# Altium project dxp.PrjPcb (part 1 of 2)
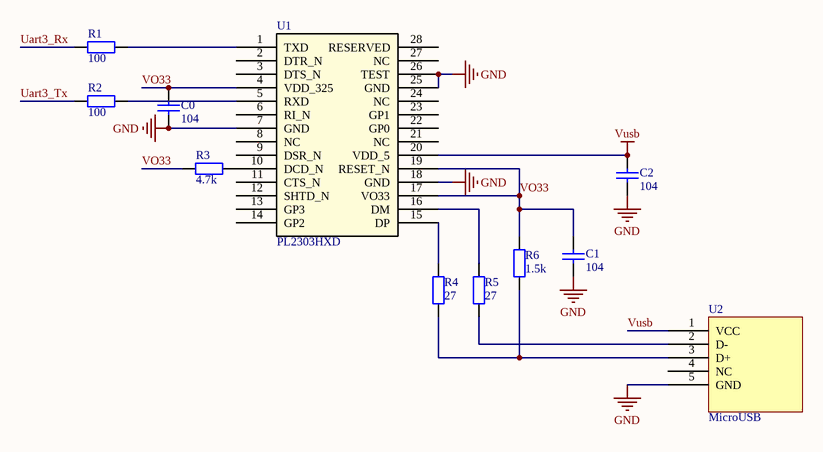
[diagram p0: PL2303EVM.SchDoc]
17 sheets, 492 parts. Net scope: flat (ports and power ports of the same name join across sheets).
Board files: PL2303EVM.PcbDoc, Cam.PcbDoc, RT8065.PcbDoc, FxxZx.PcbDoc, Stlink.PcbDoc, ArmPcb.PcbDoc, DRV8313EVM.PcbDoc, Board.PcbDoc, MPU6050EVM.PcbDoc, MainCtrl.PcbDoc, UccMod.PcbDoc, DRV8711MOD.PcbDoc, LM2596MOD.PcbDoc, Printer.PcbDoc
Sheets:
  PL2303EVM.SchDoc
  RT8065.SchDoc
  FxxVx.SchDoc
  FxxZx.SchDoc
  Stlink.SchDoc
  ArmPcb.SchDoc
  ST_All.SchDoc
  DRV8313EVM.SchDoc
  MPU6050EVM.SchDoc
  MPU9250EVM.SchDoc
  LM2596MOD.SchDoc
  BQ34Z100EVM.SchDoc
  MainCtrl.SchDoc
  DRV8711MOD.SchDoc
  UCCMod.SchDoc
  Opa365Mod.SchDoc
  Printer.SchDoc

## Sheet PL2303EVM.SchDoc
size A4

### Parts
(Parts that share a designator on the sheet are numbered #1, #2 ... from top to bottom, then left to right.)
C0  104  [0805]
C1#1  104  [0805]
C2#1  104  [0805]
R1#1  100  [0805]
R2#1  100  [0805]
R3#1  4.7k  [0805]
R4#1  27  [0805]
R5#1  27  [0805]
R6#1  1.5k  [0805]
U1#1  PL2303HXD  [SSOP28]
U2#1  MicroUSB  [USB/SM0.8-6H5]

### Nets
GND: C0.2 C1#1.2 C2#1.2 U1#1.7(GND) U1#1.18(GND) U1#1.25(GND) U1#1.26(TEST) U2#1.5(GND)
Vusb: C2#1.1 U1#1.20(VDD_5) U2#1.1(VCC)
Uart3_Rx: R1#1.2
Uart3_Tx: R2#1.2
VO33: C0.1 C1#1.1 R3#1.2 R6#1.2 U1#1.4(VDD_325) U1#1.17(VO33) U1#1.19(RESET_N)
NetR1#1_1: R1#1.1 U1#1.1(TXD)
NetR2#1_1: R2#1.1 U1#1.5(RXD)
NetR3#1_1: R3#1.1 U1#1.10(DCD_N)
NetR4#1_1: R4#1.1 R6#1.1 U2#1.3(D+)
NetR4#1_2: R4#1.2 U1#1.15(DP)
NetR5#1_1: R5#1.1 U2#1.2(D-)
NetR5#1_2: R5#1.2 U1#1.16(DM)

Not connected (* = marked no-connect by the designer): U1#1 2(DTR_N) 3(DTS_N) 6(RI_N) 8(NC) 9(DSR_N) 11(CTS_N) 12(SHTD_N) 13(GP3) 14(GP2) 21(NC) 22(GP0) 23(GP1) 24(NC) 27(NC) 28(RESERVED); U2#1 4(NC)

### Library data of the parts
C0 C1#1 C2#1 = C: Capacitor; Published: 8-Jun-2000; LatestRevisionDate: 17-Jul-2002; LatestRevisionNote: Re-released for DXP Platform.; PackageReference: RAD-0.3; Publisher: Altium Limited; PackageDescription: Radial Cap, Thru-Hole; 2 Leads; 0.3 in Pin Spacing
R1#1 R2#1 R3#1 R4#1 R5#1 R6#1 = R: Resistor; Published: 8-Jun-2000; LatestRevisionDate: 17-Jul-2002; LatestRevisionNote: Re-released for DXP Platform.; PackageReference: AXIAL-0.4; Publisher: Altium Limited; PackageDescription: Axial Device, Thru-Hole; 2 Leads; 0.4 in Pin Spacing
U1#1 = PL2303HXD: Driver; Manufacturer_Part_Number: tlc5916-q1_d_16; GENERIC_PART_NUMBER: TLC5916-Q1; Vendor: Texas Instruments; PACKAGE_DESIGNATOR: D; PIN_COUNT: 16; FAMILY_NAME: LED DRIVER; INDUSTRY_STD_PKG_TYPE: SOIC; Manufacturer: Texas Instruments; Datasheet_URL: http://www.ti.com/lit/gpn/TLC5916-Q1; Value: Value; Type: Type; RefDes: RefDes

## Sheet RT8065.SchDoc
size A4
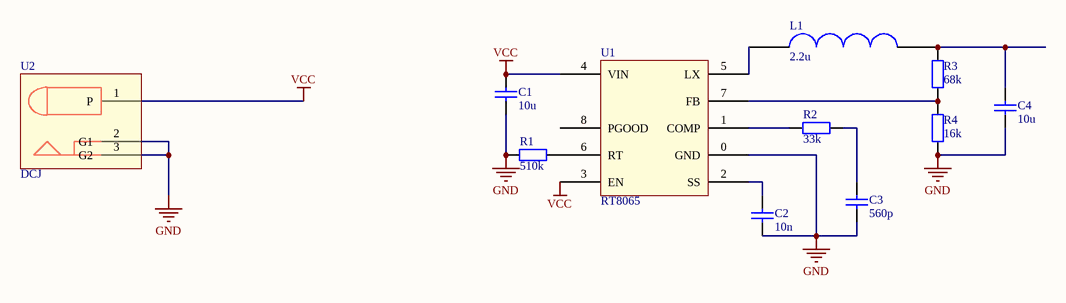
[diagram p1: RT8065.SchDoc]

### Parts
(Parts that share a designator on the sheet are numbered #1, #2 ... from top to bottom, then left to right.)
C1#2  10u  [0805]
C2#2  10n  [0805]
C3#1  560p  [0805]
C4#1  10u  [0805]
L1#1  2.2u  [L3X3MM]
R1#2  510k  [0805]
R2#2  33k  [0805]
R3#2  68k  [0805]
R4#2  16k  [0805]
U1#2  RT8065  [PSOP-8]
U2#2  DCJ  [JACK-2_5MM_B]

### Nets
GND: C1#2.1 C2#2.1 C3#1.2 C4#1.2 R1#2.1 R4#2.1 U1#2.0(GND) U2#2.2(G1) U2#2.3(G2)
VCC: C1#2.2 U1#2.3(EN) U1#2.4(VIN) U2#2.1(P)
NetC2#2_2: C2#2.2 U1#2.2(SS)
NetC3#1_1: C3#1.1 R2#2.2
NetC4#1_1: C4#1.1 L1#1.2 R3#2.2
NetL1#1_1: L1#1.1 U1#2.5(LX)
NetR1#2_2: R1#2.2 U1#2.6(RT)
NetR2#2_1: R2#2.1 U1#2.1(COMP)
NetR3#2_1: R3#2.1 R4#2.2 U1#2.7(FB)

Not connected (* = marked no-connect by the designer): U1#2 8(PGOOD)

### Library data of the parts
C1#2 C2#2 C3#1 C4#1 = C: Capacitor; Published: 8-Jun-2000; LatestRevisionDate: 17-Jul-2002; LatestRevisionNote: Re-released for DXP Platform.; PackageReference: RAD-0.3; Publisher: Altium Limited; PackageDescription: Radial Cap, Thru-Hole; 2 Leads; 0.3 in Pin Spacing
L1#1 = L
R1#2 R2#2 R3#2 R4#2 = R: Resistor; Published: 8-Jun-2000; LatestRevisionDate: 17-Jul-2002; LatestRevisionNote: Re-released for DXP Platform.; PackageReference: AXIAL-0.4; Publisher: Altium Limited; PackageDescription: Axial Device, Thru-Hole; 2 Leads; 0.4 in Pin Spacing

## Sheet FxxVx.SchDoc
size A2
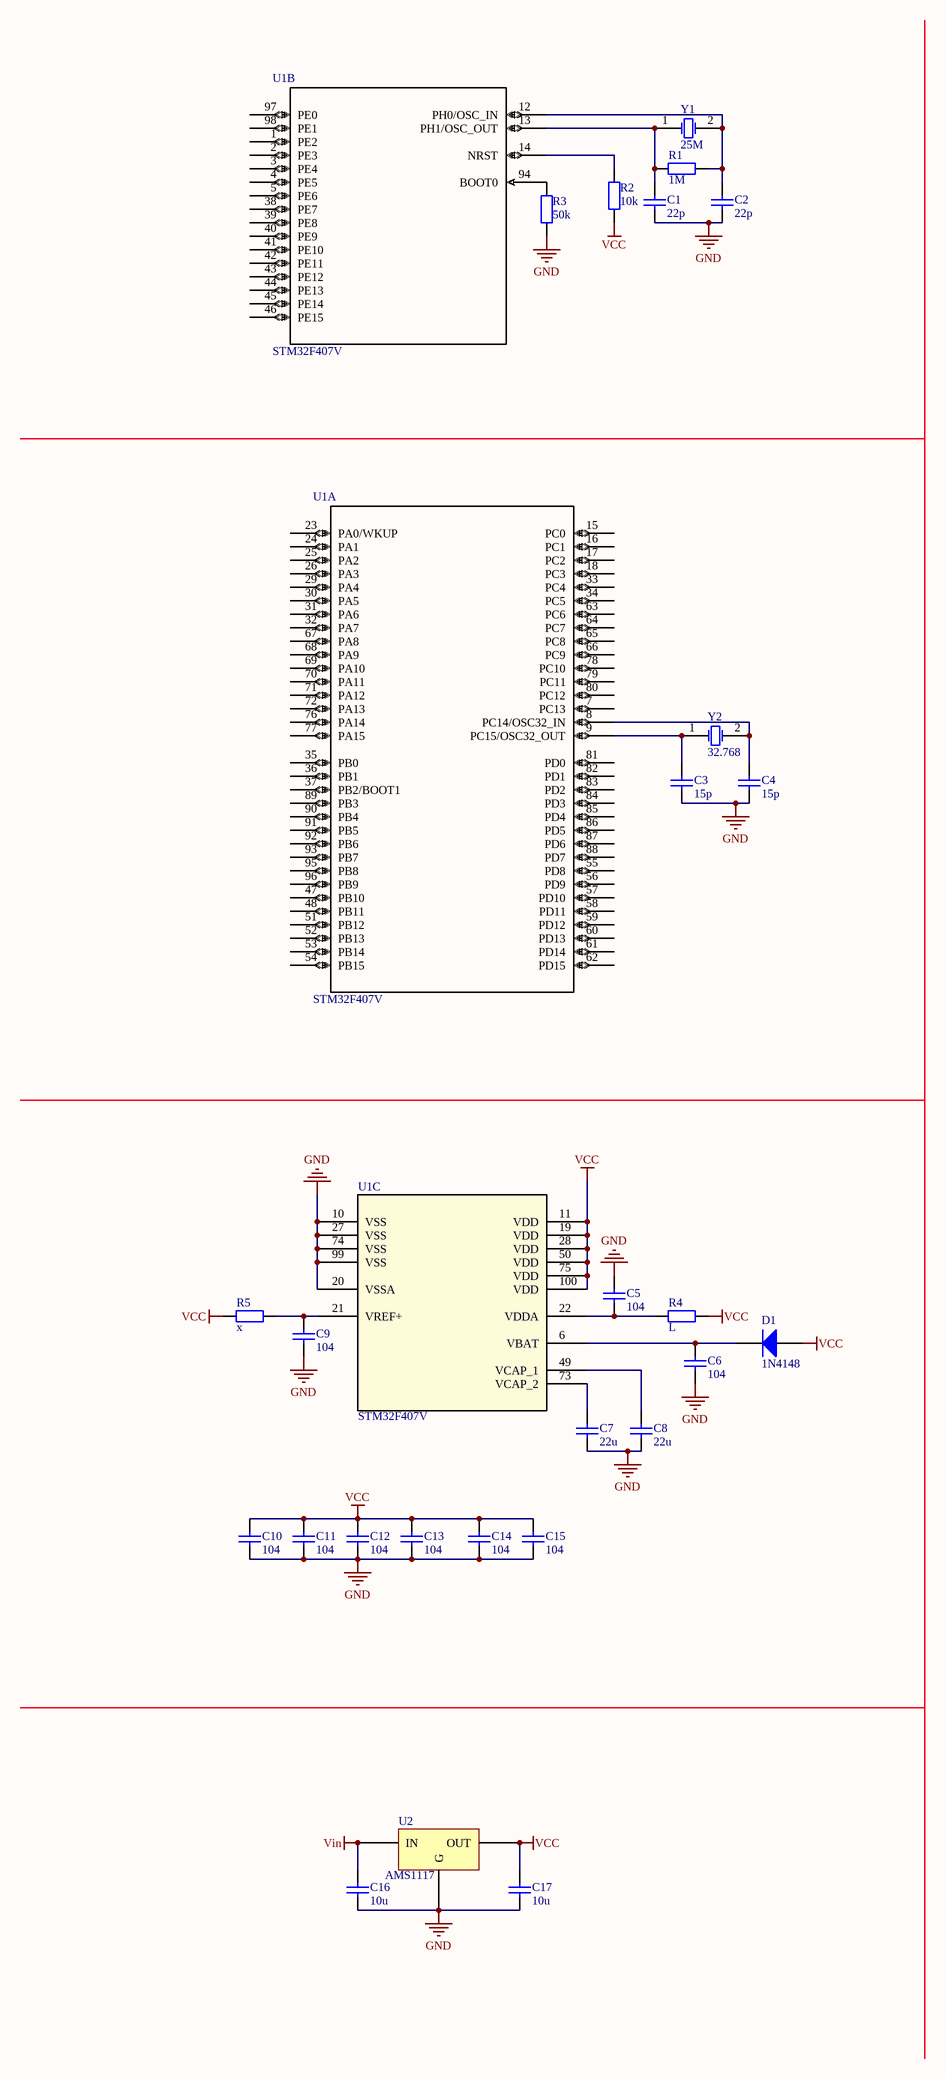
[diagram p2: FxxVx.SchDoc]

### Parts
(Parts that share a designator on the sheet are numbered #1, #2 ... from top to bottom, then left to right.)
C1#3  22p  [0603]
C2#3  22p  [0603]
C3#2  15p  [0603]
C4#2  15p  [0603]
C5#1  104  [0603]
C6#1  104  [0603]
C7#1  22u  [0603]
C8#1  22u  [0603]
C9#1  104  [0603]
C10#1  104  [0603]
C11#1  104  [0603]
C12#1  104  [0603]
C13#1  104  [0603]
C14#1  104  [0603]
C15#1  104  [0603]
C16#1  10u  [0603]
C17#1  10u  [0603]
D1#1  1N4148  [0603]
R1#3  1M  [0603]
R2#3  10k  [0603]
R3#3  50k  [0603]
R4#3  L  [0603]
R5#2  x  [0603]
U1#3  STM32F407V  [LQFP100-14x14mm]  (parts A,B,C of 3)
U2#3  AMS1117
Y1#1  25M  [3225-4]
Y2#1  32.768  [3215-2]

### Nets
GND: C1#3.1 C2#3.1 C3#2.1 C4#2.1 C5#1.2 C6#1.1 C7#1.1 C8#1.1 C9#1.1 C10#1.1 C11#1.1 C12#1.1 C13#1.1 C14#1.1 C15#1.1 C16#1.1 C17#1.1 R3#3.1 U1#3.10(VSS) U1#3.20(VSSA) U1#3.27(VSS) U1#3.74(VSS) U1#3.99(VSS) U2#3.1(G)
VCC: C10#1.2 C11#1.2 C12#1.2 C13#1.2 C14#1.2 C15#1.2 C17#1.2 D1#1.1(A) R2#3.1 R4#3.1 R5#2.2 U1#3.11(VDD) U1#3.19(VDD) U1#3.28(VDD) U1#3.50(VDD) U1#3.75(VDD) U1#3.100(VDD) U2#3.2(OUT)
Vin: C16#1.2 U2#3.3(IN)
NetC1#3_2: C1#3.2 R1#3.1 U1#3.13(PH1/OSC_OUT) Y1#1.1(OSC1)
NetC2#3_2: C2#3.2 R1#3.2 U1#3.12(PH0/OSC_IN) Y1#1.2(OSC2)
NetC3#2_2: C3#2.2 U1#3.9(PC15/OSC32_OUT) Y2#1.1(OSC1)
NetC4#2_2: C4#2.2 U1#3.8(PC14/OSC32_IN) Y2#1.2(OSC2)
NetC5#1_1: C5#1.1 R4#3.2 U1#3.22(VDDA)
NetC6#1_2: C6#1.2 D1#1.2(K) U1#3.6(VBAT)
NetC7#1_2: C7#1.2 U1#3.73(VCAP_2)
NetC8#1_2: C8#1.2 U1#3.49(VCAP_1)
NetC9#1_2: C9#1.2 R5#2.1 U1#3.21(VREF+)
NetR2#3_2: R2#3.2 U1#3.14(NRST)
NetR3#3_2: R3#3.2 U1#3.94(BOOT0)

Not connected (* = marked no-connect by the designer): U1#3 1(PE2) 2(PE3) 3(PE4) 4(PE5) 5(PE6) 7(PC13) 15(PC0) 16(PC1) 17(PC2) 18(PC3) 23(PA0/WKUP) 24(PA1) 25(PA2) 26(PA3) 29(PA4) 30(PA5) 31(PA6) 32(PA7) 33(PC4) 34(PC5) 35(PB0) 36(PB1) 37(PB2/BOOT1) 38(PE7) 39(PE8) 40(PE9) 41(PE10) 42(PE11) 43(PE12) 44(PE13) 45(PE14) 46(PE15) 47(PB10) 48(PB11) 51(PB12) 52(PB13) 53(PB14) 54(PB15) 55(PD8) 56(PD9) 57(PD10) 58(PD11) 59(PD12) 60(PD13) 61(PD14) 62(PD15) 63(PC6) 64(PC7) 65(PC8) 66(PC9) 67(PA8) 68(PA9) 69(PA10) 70(PA11) 71(PA12) 72(PA13) 76(PA14) 77(PA15) 78(PC10) 79(PC11) 80(PC12) 81(PD0) 82(PD1) 83(PD2) 84(PD3) 85(PD4) 86(PD5) 87(PD6) 88(PD7) 89(PB3) 90(PB4) 91(PB5) 92(PB6) 93(PB7) 95(PB8) 96(PB9) 97(PE0) 98(PE1)

### Notes on the sheet
- Title
- Size:
- Date:
- File:
- A2
- Number:
- Time:
- Revision:
- Sheet
- of

### Library data of the parts
C1#3 C2#3 C3#2 C4#2 C5#1 C6#1 C7#1 C8#1 C9#1 C10#1 C11#1 C12#1 C13#1 C14#1 C15#1 C16#1 C17#1 = C: Capacitor; Published: 8-Jun-2000; LatestRevisionDate: 17-Jul-2002; LatestRevisionNote: Re-released for DXP Platform.; PackageReference: RAD-0.3; Publisher: Altium Limited; PackageDescription: Radial Cap, Thru-Hole; 2 Leads; 0.3 in Pin Spacing
D1#1 = D: Diode; Published: 8-Jun-2000; LatestRevisionDate: 17-Jul-2002; LatestRevisionNote: Re-released for DXP Platform.; PackageVersion: Sep-1996; PackageReference: SMC; Publisher: Altium Limited; PackageDescription: DO-214-AB/SMC; 2 C-Bend Leads; Body 7.9 x 5.9 mm, inc. leads (LxW); Code_JEDEC: DO-214-AB
R1#3 R2#3 R3#3 R4#3 R5#2 = R: Resistor; Published: 8-Jun-2000; LatestRevisionDate: 17-Jul-2002; LatestRevisionNote: Re-released for DXP Platform.; PackageReference: AXIAL-0.4; Publisher: Altium Limited; PackageDescription: Axial Device, Thru-Hole; 2 Leads; 0.4 in Pin Spacing
U1#3 = STM32F407V: Imported; Manufacturer_Part_Number: stm32f4xxv2; Vendor: STMicroelectronics; C: Copyright (C) 2016 Accelerated Designs. All rights reserved; Copyright: Copyright (C) 2016 Accelerated Designs. All rights reserved; RefDes: RefDes; Type: Type; Value: Value
Y1#1 = XTAL: Crystal Oscillator; pin to pad: 2>3; Published: 8-Jun-2000; LatestRevisionDate: 17-Jul-2002; LatestRevisionNote: Re-released for DXP Platform.; Publisher: Altium Limited
Y2#1 = XTAL: Crystal Oscillator; Published: 8-Jun-2000; LatestRevisionDate: 17-Jul-2002; LatestRevisionNote: Re-released for DXP Platform.; Publisher: Altium Limited

## Sheet FxxZx.SchDoc
size A2
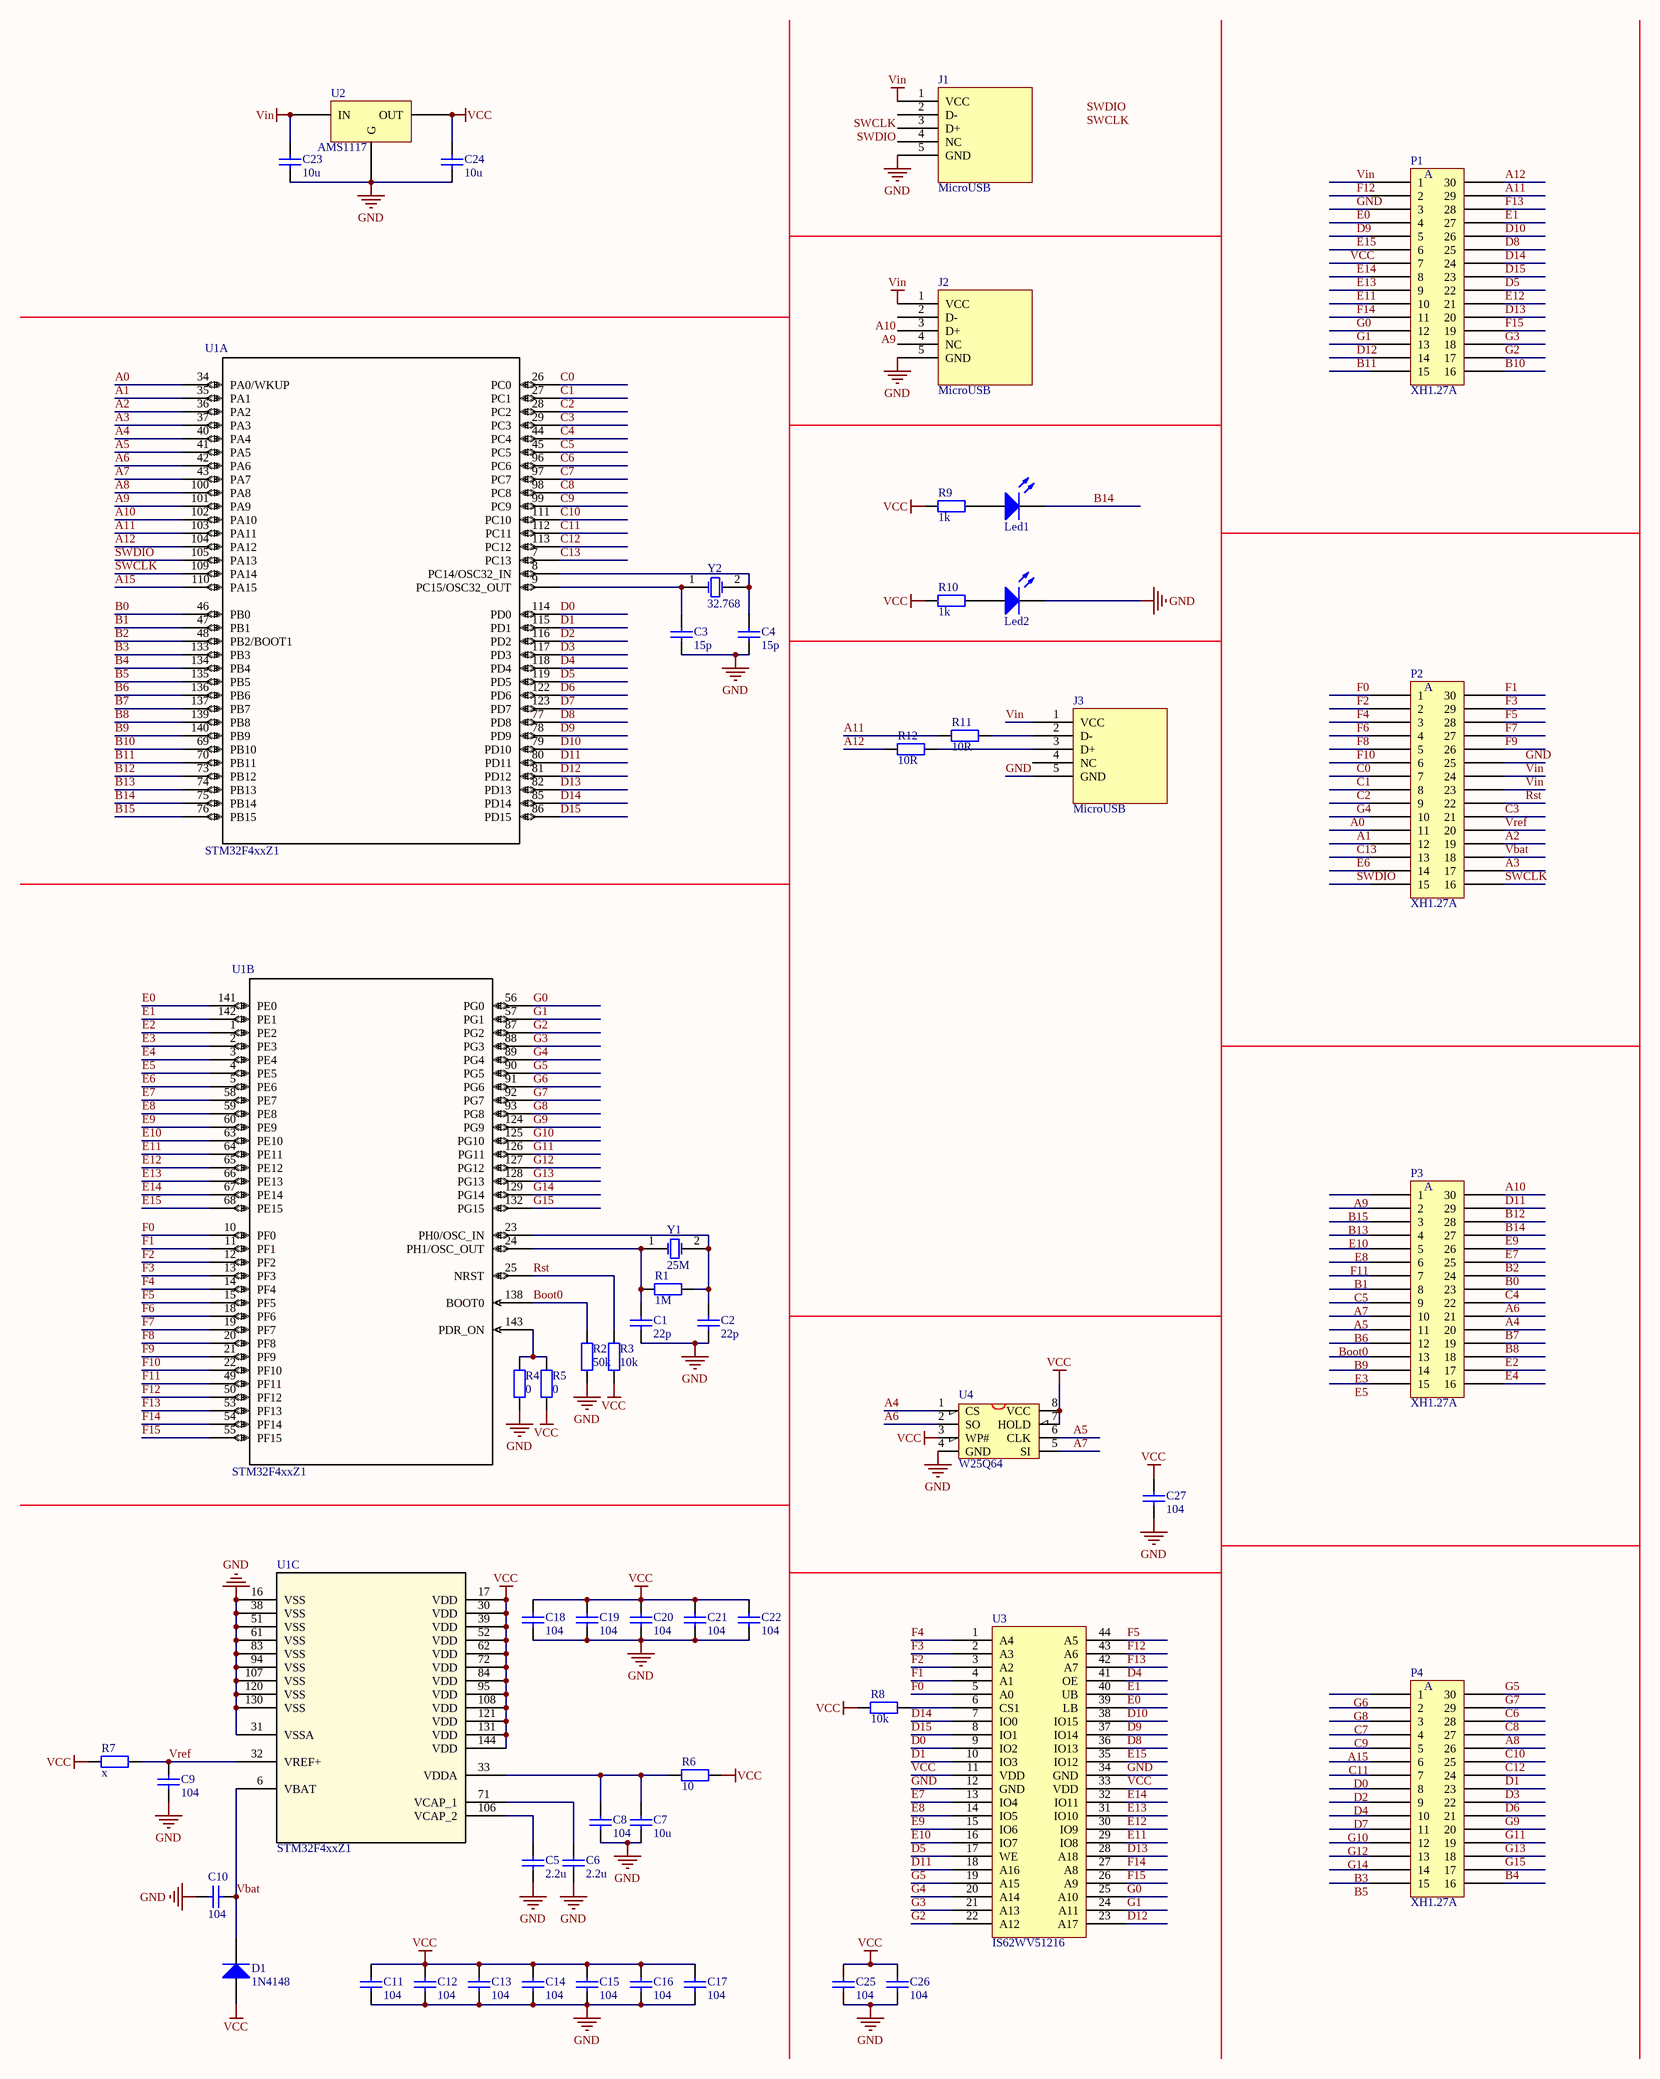
[diagram p3: FxxZx.SchDoc]

### Parts
(Parts that share a designator on the sheet are numbered #1, #2 ... from top to bottom, then left to right.)
C1#4  22p  [0603]
C2#4  22p  [0603]
C3#3  15p  [0603]
C4#3  15p  [0603]
C5#2  2.2u  [0603]
C6#2  2.2u  [0603]
C7#2  10u  [0603]
C8#2  104  [0603]
C9#2  104  [0603]
C10#2  104  [0603]
C11#2  104  [0603]
C12#2  104  [0603]
C13#2  104  [0603]
C14#2  104  [0603]
C15#2  104  [0603]
C16#2  104  [0603]
C17#2  104  [0603]
C18#1  104  [0603]
C19#1  104  [0603]
C20#1  104  [0603]
C21#1  104  [0603]
C22#1  104  [0603]
C23#1  10u  [0805]
C24#1  10u  [0805]
C25#1  104  [0603]
C26#1  104  [0603]
C27#1  104  [0603]
D1#2  1N4148  [0603]
J1#1  MicroUSB  [USB/SM0.8-6H5]
J2#1  MicroUSB  [USB/SM0.8-6H5]
J3#1  MicroUSB  [USB/SM0.8-6H5]
Led1  Red  [0805]  (value not drawn)
Led2  Red  [0805]  (value not drawn)
P1#1  XH1.27A  [XH1.27A]
P2#1  XH1.27A  [XH1.27A]
P3#1  XH1.27A  [XH1.27A]
P4#1  XH1.27A  [XH1.27A]
R1#4  1M  [0603]
R2#4  50k  [0603]
R3#4  10k  [0603]
R4#4  0  [0603]
R5#3  0  [0603]
R6#2  10  [0603]
R7#1  x  [0603]
R8#1  10k  [0603]
R9#1  1k  [0603]
R10#1  1k  [0603]
R11#1  10R  [0603]
R12#1  10R  [0603]
U1#4  STM32F4xxZ1  [LQFP144-20x20mm]  (parts A,B,C of 3)
U2#4  AMS1117  [SOT-89]
U3#1  IS62WV51216  [tsop-44]
U4#1  W25Q64  [SOIC-8]
Y1#2  25M  [3225-4]
Y2#2  32.768  [3215-2]

### Nets
GND: C1#4.1 C2#4.1 C3#3.1 C4#3.1 C5#2.1 C6#2.1 C7#2.1 C8#2.1 C9#2.1 C10#2.1 C11#2.1 C12#2.1 C13#2.1 C14#2.1 C15#2.1 C16#2.1 C17#2.1 C18#1.1 C19#1.1 C20#1.1 C21#1.1 C22#1.1 C23#1.1 C24#1.1 C25#1.1 C26#1.1 C27#1.1 J1#1.5(GND) J2#1.5(GND) J3#1.5(GND) Led2.2(K) P1#1.3 P2#1.25 R2#4.1 R4#4.1 U1#4.16(VSS) U1#4.31(VSSA) U1#4.38(VSS) U1#4.51(VSS) U1#4.61(VSS) U1#4.83(VSS) U1#4.94(VSS) U1#4.107(VSS) U1#4.120(VSS) U1#4.130(VSS) U2#4.1(G) U3#1.12(GND) U3#1.34(GND) U4#1.4(GND)
VCC: C11#2.2 C12#2.2 C13#2.2 C14#2.2 C15#2.2 C16#2.2 C17#2.2 C18#1.2 C19#1.2 C20#1.2 C21#1.2 C22#1.2 C24#1.2 C25#1.2 C26#1.2 C27#1.2 D1#2.1(A) P1#1.7 R3#4.1 R5#3.1 R6#2.1 R7#1.2 R8#1.2 R9#1.2 R10#1.2 U1#4.17(VDD) U1#4.30(VDD) U1#4.39(VDD) U1#4.52(VDD) U1#4.62(VDD) U1#4.72(VDD) U1#4.84(VDD) U1#4.95(VDD) U1#4.108(VDD) U1#4.121(VDD) U1#4.131(VDD) U1#4.144(VDD) U2#4.2(OUT) U3#1.11(VDD) U3#1.33(VDD) U4#1.3(WP#) U4#1.7(HOLD) U4#1.8(VCC)
Vin: C23#1.2 J1#1.1(VCC) J2#1.1(VCC) J3#1.1(VCC) P1#1.1 P2#1.23 P2#1.24 U2#4.3(IN)
A0: P2#1.11 U1#4.34(PA0/WKUP)
A1: P2#1.12 U1#4.35(PA1)
A2: P2#1.19 U1#4.36(PA2)
A3: P2#1.17 U1#4.37(PA3)
A4: P3#1.20 U1#4.40(PA4) U4#1.1(CS)
A5: P3#1.10 U1#4.41(PA5) U4#1.6(CLK)
A6: P3#1.21 U1#4.42(PA6) U4#1.2(SO)
A7: P3#1.9 U1#4.43(PA7) U4#1.5(SI)
A8: P4#1.26 U1#4.100(PA8)
A9: J2#1.3(D+) P3#1.1 U1#4.101(PA9)
A10: J2#1.2(D-) P3#1.30 U1#4.102(PA10)
A11: P1#1.29 R11#1.2 U1#4.103(PA11)
A12: P1#1.30 R12#1.2 U1#4.104(PA12)
A15: P4#1.5 U1#4.110(PA15)
B0: P3#1.23 U1#4.46(PB0)
B1: P3#1.7 U1#4.47(PB1)
B2: P3#1.24 U1#4.48(PB2/BOOT1)
B3: P4#1.14 U1#4.133(PB3)
B4: P4#1.16 U1#4.134(PB4)
B5: P4#1.15 U1#4.135(PB5)
B6: P3#1.11 U1#4.136(PB6)
B7: P3#1.19 U1#4.137(PB7)
B8: P3#1.18 U1#4.139(PB8)
B9: P3#1.13 U1#4.140(PB9)
B10: P1#1.16 U1#4.69(PB10)
B11: P1#1.15 U1#4.70(PB11)
B12: P3#1.28 U1#4.73(PB12)
B13: P3#1.3 U1#4.74(PB13)
B14: Led1.2(K) P3#1.27 U1#4.75(PB14)
B15: P3#1.2 U1#4.76(PB15)
Boot0: P3#1.12 R2#4.2 U1#4.138(BOOT0)
C0: P2#1.7 U1#4.26(PC0)
C1: P2#1.8 U1#4.27(PC1)
C2: P2#1.9 U1#4.28(PC2)
C3: P2#1.21 U1#4.29(PC3)
C4: P3#1.22 U1#4.44(PC4)
C5: P3#1.8 U1#4.45(PC5)
C6: P4#1.28 U1#4.96(PC6)
C7: P4#1.3 U1#4.97(PC7)
C8: P4#1.27 U1#4.98(PC8)
C9: P4#1.4 U1#4.99(PC9)
C10: P4#1.25 U1#4.111(PC10)
C11: P4#1.6 U1#4.112(PC11)
C12: P4#1.24 U1#4.113(PC12)
C13: P2#1.13 U1#4.7(PC13)
D0: P4#1.7 U1#4.114(PD0) U3#1.9(IO2)
D1: P4#1.23 U1#4.115(PD1) U3#1.10(IO3)
D2: P4#1.8 U1#4.116(PD2)
D3: P4#1.22 U1#4.117(PD3)
D4: P4#1.9 U1#4.118(PD4) U3#1.41(OE)
D5: P1#1.22 U1#4.119(PD5) U3#1.17(WE)
D6: P4#1.21 U1#4.122(PD6)
D7: P4#1.10 U1#4.123(PD7)
D8: P1#1.25 U1#4.77(PD8) U3#1.36(IO13)
D9: P1#1.5 U1#4.78(PD9) U3#1.37(IO14)
D10: P1#1.26 U1#4.79(PD10) U3#1.38(IO15)
D11: P3#1.29 U1#4.80(PD11) U3#1.18(A16)
D12: P1#1.14 U1#4.81(PD12) U3#1.23(A17)
D13: P1#1.20 U1#4.82(PD13) U3#1.28(A18)
D14: P1#1.24 U1#4.85(PD14) U3#1.7(IO0)
D15: P1#1.23 U1#4.86(PD15) U3#1.8(IO1)
E0: P1#1.4 U1#4.141(PE0) U3#1.39(LB)
E1: P1#1.27 U1#4.142(PE1) U3#1.40(UB)
E2: P3#1.17 U1#4.1(PE2)
E3: P3#1.14 U1#4.2(PE3)
E4: P3#1.16 U1#4.3(PE4)
E5: P3#1.15 U1#4.4(PE5)
E6: P2#1.14 U1#4.5(PE6)
E7: P3#1.25 U1#4.58(PE7) U3#1.13(IO4)
E8: P3#1.5 U1#4.59(PE8) U3#1.14(IO5)
E9: P3#1.26 U1#4.60(PE9) U3#1.15(IO6)
E10: P3#1.4 U1#4.63(PE10) U3#1.16(IO7)
E11: P1#1.10 U1#4.64(PE11) U3#1.29(IO8)
E12: P1#1.21 U1#4.65(PE12) U3#1.30(IO9)
E13: P1#1.9 U1#4.66(PE13) U3#1.31(IO10)
E14: P1#1.8 U1#4.67(PE14) U3#1.32(IO11)
E15: P1#1.6 U1#4.68(PE15) U3#1.35(IO12)
F0: P2#1.1 U1#4.10(PF0) U3#1.5(A0)
F1: P2#1.30 U1#4.11(PF1) U3#1.4(A1)
F2: P2#1.2 U1#4.12(PF2) U3#1.3(A2)
F3: P2#1.29 U1#4.13(PF3) U3#1.2(A3)
F4: P2#1.3 U1#4.14(PF4) U3#1.1(A4)
F5: P2#1.28 U1#4.15(PF5) U3#1.44(A5)
F6: P2#1.4 U1#4.18(PF6)
F7: P2#1.27 U1#4.19(PF7)
F8: P2#1.5 U1#4.20(PF8)
F9: P2#1.26 U1#4.21(PF9)
F10: P2#1.6 U1#4.22(PF10)
F11: P3#1.6 U1#4.49(PF11)
F12: P1#1.2 U1#4.50(PF12) U3#1.43(A6)
F13: P1#1.28 U1#4.53(PF13) U3#1.42(A7)
F14: P1#1.11 U1#4.54(PF14) U3#1.27(A8)
F15: P1#1.19 U1#4.55(PF15) U3#1.26(A9)
G0: P1#1.12 U1#4.56(PG0) U3#1.25(A10)
G1: P1#1.13 U1#4.57(PG1) U3#1.24(A11)
G2: P1#1.17 U1#4.87(PG2) U3#1.22(A12)
G3: P1#1.18 U1#4.88(PG3) U3#1.21(A13)
G4: P2#1.10 U1#4.89(PG4) U3#1.20(A14)
G5: P4#1.30 U1#4.90(PG5) U3#1.19(A15)
G6: P4#1.1 U1#4.91(PG6)
G7: P4#1.29 U1#4.92(PG7)
G8: P4#1.2 U1#4.93(PG8)
G9: P4#1.20 U1#4.124(PG9)
G10: P4#1.11 U1#4.125(PG10)
G11: P4#1.19 U1#4.126(PG11)
G12: P4#1.12 U1#4.127(PG12)
G13: P4#1.18 U1#4.128(PG13)
G14: P4#1.13 U1#4.129(PG14)
G15: P4#1.17 U1#4.132(PG15)
Rst: P2#1.22 R3#4.2 U1#4.25(NRST)
SWCLK: J1#1.2(D-) P2#1.16 U1#4.109(PA14)
SWDIO: J1#1.3(D+) P2#1.15 U1#4.105(PA13)
Vbat: C10#2.2 D1#2.2(K) P2#1.18 U1#4.6(VBAT)
Vref: C9#2.2 P2#1.20 R7#1.1 U1#4.32(VREF+)
NetC1#4_2: C1#4.2 R1#4.1 U1#4.24(PH1/OSC_OUT) Y1#2.1(OSC1)
NetC2#4_2: C2#4.2 R1#4.2 U1#4.23(PH0/OSC_IN) Y1#2.2(OSC2)
NetC3#3_2: C3#3.2 U1#4.9(PC15/OSC32_OUT) Y2#2.1(OSC1)
NetC4#3_2: C4#3.2 U1#4.8(PC14/OSC32_IN) Y2#2.2(OSC2)
NetC5#2_2: C5#2.2 U1#4.106(VCAP_2)
NetC6#2_2: C6#2.2 U1#4.71(VCAP_1)
NetC7#2_2: C7#2.2 C8#2.2 R6#2.2 U1#4.33(VDDA)
NetJ3#1_2: J3#1.2(D-) R11#1.1
NetJ3#1_3: J3#1.3(D+) R12#1.1
NetLed1_1: Led1.1(A) R9#1.1
NetLed2_1: Led2.1(A) R10#1.1
NetR4#4_2: R4#4.2 R5#3.2 U1#4.143(PDR_ON)
NetR8#1_1: R8#1.1 U3#1.6(CS1)

Not connected (* = marked no-connect by the designer): J1#1 4(NC); J2#1 4(NC); J3#1 4(NC)

### Notes on the sheet
- Labels drawn without touching a wire or pin: SWCLK, SWDIO
- Title
- Size:
- Date:
- File:
- A2
- Number:
- Time:
- Revision:
- Sheet
- of
- (in symbol XH1.27A) A

### Library data of the parts
C1#4 C2#4 C3#3 C4#3 C5#2 C6#2 C7#2 C8#2 C9#2 C10#2 C11#2 C12#2 C13#2 C14#2 C15#2 C16#2 C17#2 C18#1 C19#1 C20#1 C21#1 C22#1 C23#1 C24#1 C25#1 C26#1 C27#1 = C: Capacitor; Published: 8-Jun-2000; LatestRevisionDate: 17-Jul-2002; LatestRevisionNote: Re-released for DXP Platform.; PackageReference: RAD-0.3; Publisher: Altium Limited; PackageDescription: Radial Cap, Thru-Hole; 2 Leads; 0.3 in Pin Spacing
D1#2 = D: Diode; Published: 8-Jun-2000; LatestRevisionDate: 17-Jul-2002; LatestRevisionNote: Re-released for DXP Platform.; PackageVersion: Sep-1996; PackageReference: SMC; Publisher: Altium Limited; PackageDescription: DO-214-AB/SMC; 2 C-Bend Leads; Body 7.9 x 5.9 mm, inc. leads (LxW); Code_JEDEC: DO-214-AB
Led1 Led2 = LED: Published: 8-Jun-2000; LatestRevisionDate: 08-Jul-2005; LatestRevisionNote: Mech Layer 1 removed.; PackageReference: LED-0; Publisher: Altium Limited; PackageDescription: LED; 2 Leads
R1#4 R2#4 R3#4 R4#4 R5#3 R6#2 R7#1 R8#1 R9#1 R10#1 R11#1 R12#1 = R: Resistor; Published: 8-Jun-2000; LatestRevisionDate: 17-Jul-2002; LatestRevisionNote: Re-released for DXP Platform.; PackageReference: AXIAL-0.4; Publisher: Altium Limited; PackageDescription: Axial Device, Thru-Hole; 2 Leads; 0.4 in Pin Spacing
U1#4 = STM32F4xxZ1: Imported; Vendor: STMicroelectronics; C: Copyright (C) 2016 Accelerated Designs. All rights reserved; Manufacturer_Part_Number: stm32f4xxz1; Copyright: Copyright (C) 2016 Accelerated Designs. All rights reserved; RefDes: RefDes; Type: Type; Value: Value
U4#1 = W25X16: W25X16;SST25VF016;MX25L1605
Y1#2 = XTAL: Crystal Oscillator; pin to pad: 2>3; Published: 8-Jun-2000; LatestRevisionDate: 17-Jul-2002; LatestRevisionNote: Re-released for DXP Platform.; Publisher: Altium Limited
Y2#2 = XTAL: Crystal Oscillator; Published: 8-Jun-2000; LatestRevisionDate: 17-Jul-2002; LatestRevisionNote: Re-released for DXP Platform.; Publisher: Altium Limited

## Sheet Stlink.SchDoc
size A4; Revision: B.2(PCB.SCH)
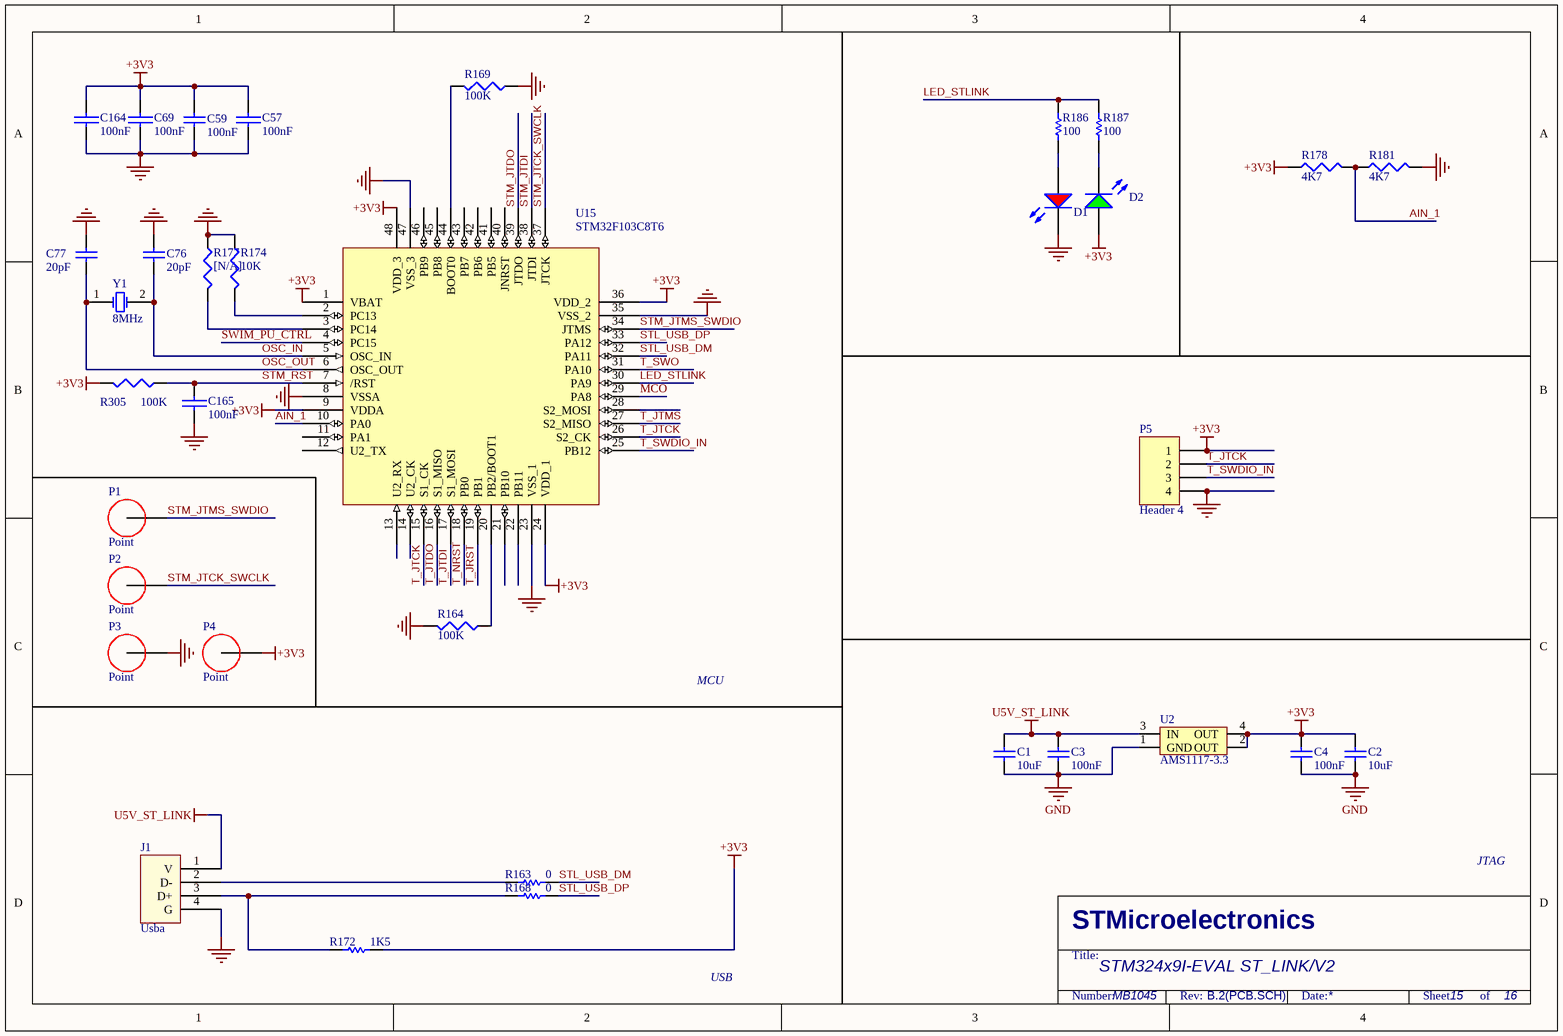
[diagram p4: Stlink.SchDoc]

### Parts
(Parts that share a designator on the sheet are numbered #1, #2 ... from top to bottom, then left to right.)
C1#5  10uF  [0805_C]
C2#5  10uF  [0805_C]
C3#4  100nF  [0603_C]
C4#4  100nF  [0603_C]
C57  100nF  [0603_C]
C59  100nF  [0603_C]
C69  100nF  [0603_C]
C76  20pF  [0603_C]
C77  20pF  [0603_C]
C164  100nF  [0603_C]
C165  100nF  [0603_C]
D1#3  红灯 0805  [0805_LED_S1]  (value not drawn)
D2#1  翠绿 0805  [0805_LED_S1]  (value not drawn)
J1#2  Usba  [UsbA]
P1#2  Point  [POINT]
P2#2  Point  [POINT]
P3#2  Point  [POINT]
P4#2  Point  [POINT]
P5#1  Header 4  [HDR1X4]
R163  0  [0603_R]
R164  100K  [0603_R]
R168  0  [0603_R]
R169  100K  [0603_R]
R172  1K5  [0603_R]
R174  10K  [0603_R]
R177  [N/A]  [0603_R]
R178  4K7  [0603_R]
R181  4K7  [0603_R]
R186  100  [0603_R]
R187  100  [0603_R]
R305  100K  [0603_R]
U2#5  AMS1117-3.3  [AMS1117]
U15  STM32F103C8T6  [LQFP-48_7x7x05P]
Y1#3  8MHz  [XTAL_US]

### Nets
+3V3: C2#5.2 C4#4.2 C57.2 C59.1 C69.2 C164.2 D2#1.A P4#2.1 P5#1.1 R172.1 R178.1 R305.2 U2#5.2(OUT) U2#5.4(OUT) U15.1(VBAT) U15.9(VDDA) U15.24(VDD_1) U15.36(VDD_2) U15.48(VDD_3)
GND: C1#5.1 C2#5.1 C3#4.1 C4#4.1 C57.1 C59.2 C69.1 C76.1 C77.1 C164.1 C165.1 D1#3.K J1#2.4(G) P3#2.1 P5#1.4 R164.2 R169.1 R174.1 R177.1 R181.2 U2#5.1(GND) U15.8(VSSA) U15.23(VSS_1) U15.35(VSS_2) U15.47(VSS_3)
U5V_ST_LINK: C1#5.2 C3#4.2 J1#2.1(V) U2#5.3(IN)
AIN_1: R178.2 R181.1 U15.10(PA0)
LED_STLINK: R186.1 R187.1 U15.30(PA9)
MCO: U15.29(PA8)
OSC_IN: C76.2 U15.5(OSC_IN) Y1#3.2(OSC2)
OSC_OUT: C77.2 U15.6(OSC_OUT) Y1#3.1(OSC1)
STL_USB_DM: R163.1 U15.32(PA11)
STL_USB_DP: R168.1 U15.33(PA12)
STM_JTCK_SWCLK: P2#2.1 U15.37(JTCK)
STM_JTDI: U15.38(JTDI)
STM_JTDO: U15.39(JTDO)
STM_JTMS_SWDIO: P1#2.1 U15.34(JTMS)
STM_RST: C165.2 R305.1 U15.7(/RST)
SWIM_PU_CTRL: U15.4(PC15)
T_JRST: U15.19(PB1)
T_JTCK: P5#1.2 U15.15(S1_CK) U15.26(S2_CK)
T_JTDI: U15.17(S1_MOSI)
T_JTDO: U15.16(S1_MISO)
T_JTMS: U15.27(S2_MISO)
T_NRST: U15.18(PB0)
T_SWDIO_IN: P5#1.3 U15.25(PB12)
T_SWO: U15.31(PA10)
NetD1#3_A: D1#3.A R186.2
NetD2#1_K: D2#1.K R187.2
NetJ1#2_2: J1#2.2(D-) R163.2
NetJ1#2_3: J1#2.3(D+) R168.2 R172.2
NetR164_1: R164.1 U15.20(PB2/BOOT1)
NetR169_2: R169.2 U15.44(BOOT0)
NetR174_2: R174.2 U15.2(PC13)
NetR177_2: R177.2 U15.3(PC14)

Not connected (* = marked no-connect by the designer): U15 11(PA1) 12(U2_TX) 13(U2_RX) 14(U2_CK) 21(PB10) 22(PB11) 28(S2_MOSI) 40(JNRST) 41(PB5) 42(PB6) 43(PB7) 45(PB8) 46(PB9)

### Notes on the sheet
- MCU
- JTAG
- USB
- STM324x9I-EVAL ST_LINK/V2
- MB1045
- 15
- 16
- STMicroelectronics
- Title:
- Number:
- Rev:
- Date:
- Sheet          of

### Library data of the parts
C1#5 C2#5 = 0805 10uF (106) 10% 25V: 贴片电容; ComponentLink1Description: 供应商链接; ComponentLink1URL: http://www.szlcsc.com/product/details_16532.html; Package: 0805; Supplier: LC; SuppliersPartNumber: C15850
C3#4 C4#4 = 0603 100nF (104) 10% 50V: 贴片电容; ComponentLink1Description: 供应商链接; ComponentLink1URL: http://www.szlcsc.com/product/details_15331.html; Package: 0603; Supplier: LC; SuppliersPartNumber: C14663
C57 C69 C164 C165 = CAP
C59 = Cap: Capacitor; Value: 10nF; Published: 8-Jun-2000; Revision: July-2002: Re-released for DXP Platform.; Publisher: Altium Limited
C76 C77 = Cap: Capacitor; Published: 8-Jun-2000; LatestRevisionDate: 17-Jul-2002; LatestRevisionNote: Re-released for DXP Platform.; PackageReference: RAD-0.3; Publisher: Altium Limited; Value: 20pF
D1#3 = 0805 红灯: 发光二极管; ComponentLink1Description: 供应商链接; ComponentLink1URL: http://www.szlcsc.com/product/details_2668.html; Package: 0805; Supplier: LC; SuppliersPartNumber: C2295
D2#1 = 0805 翠绿: 发光二极管; ComponentLink1Description: 供应商链接; ComponentLink1URL: http://www.szlcsc.com/product/details_2670.html; Package: 0805; Supplier: LC; SuppliersPartNumber: C2297
P5#1 = Header 4: Header, 4-Pin; LatestRevisionDate: 17-Jul-2002; LatestRevisionNote: Re-released for DXP Platform.; Publisher: Altium Limited
R163 R168 R172 R186 R187 = Res1: Resistor; Value: 1K; Published: 8-Jun-2000; Revision: July-2002: Re-released for DXP Platform.; Publisher: Altium Limited
R164 R169 R178 R181 R305 = RES1
R174 R177 = R: Right: 20; Bottom: 30
U2#5 = AMS1117
U15 = STM32F10x(48pin)
Y1#3 = XTAL: Crystal Oscillator; Published: 8-Jun-2000; LatestRevisionDate: 17-Jul-2002; LatestRevisionNote: Re-released for DXP Platform.; Publisher: Altium Limited

## Sheet ArmPcb.SchDoc
size A2
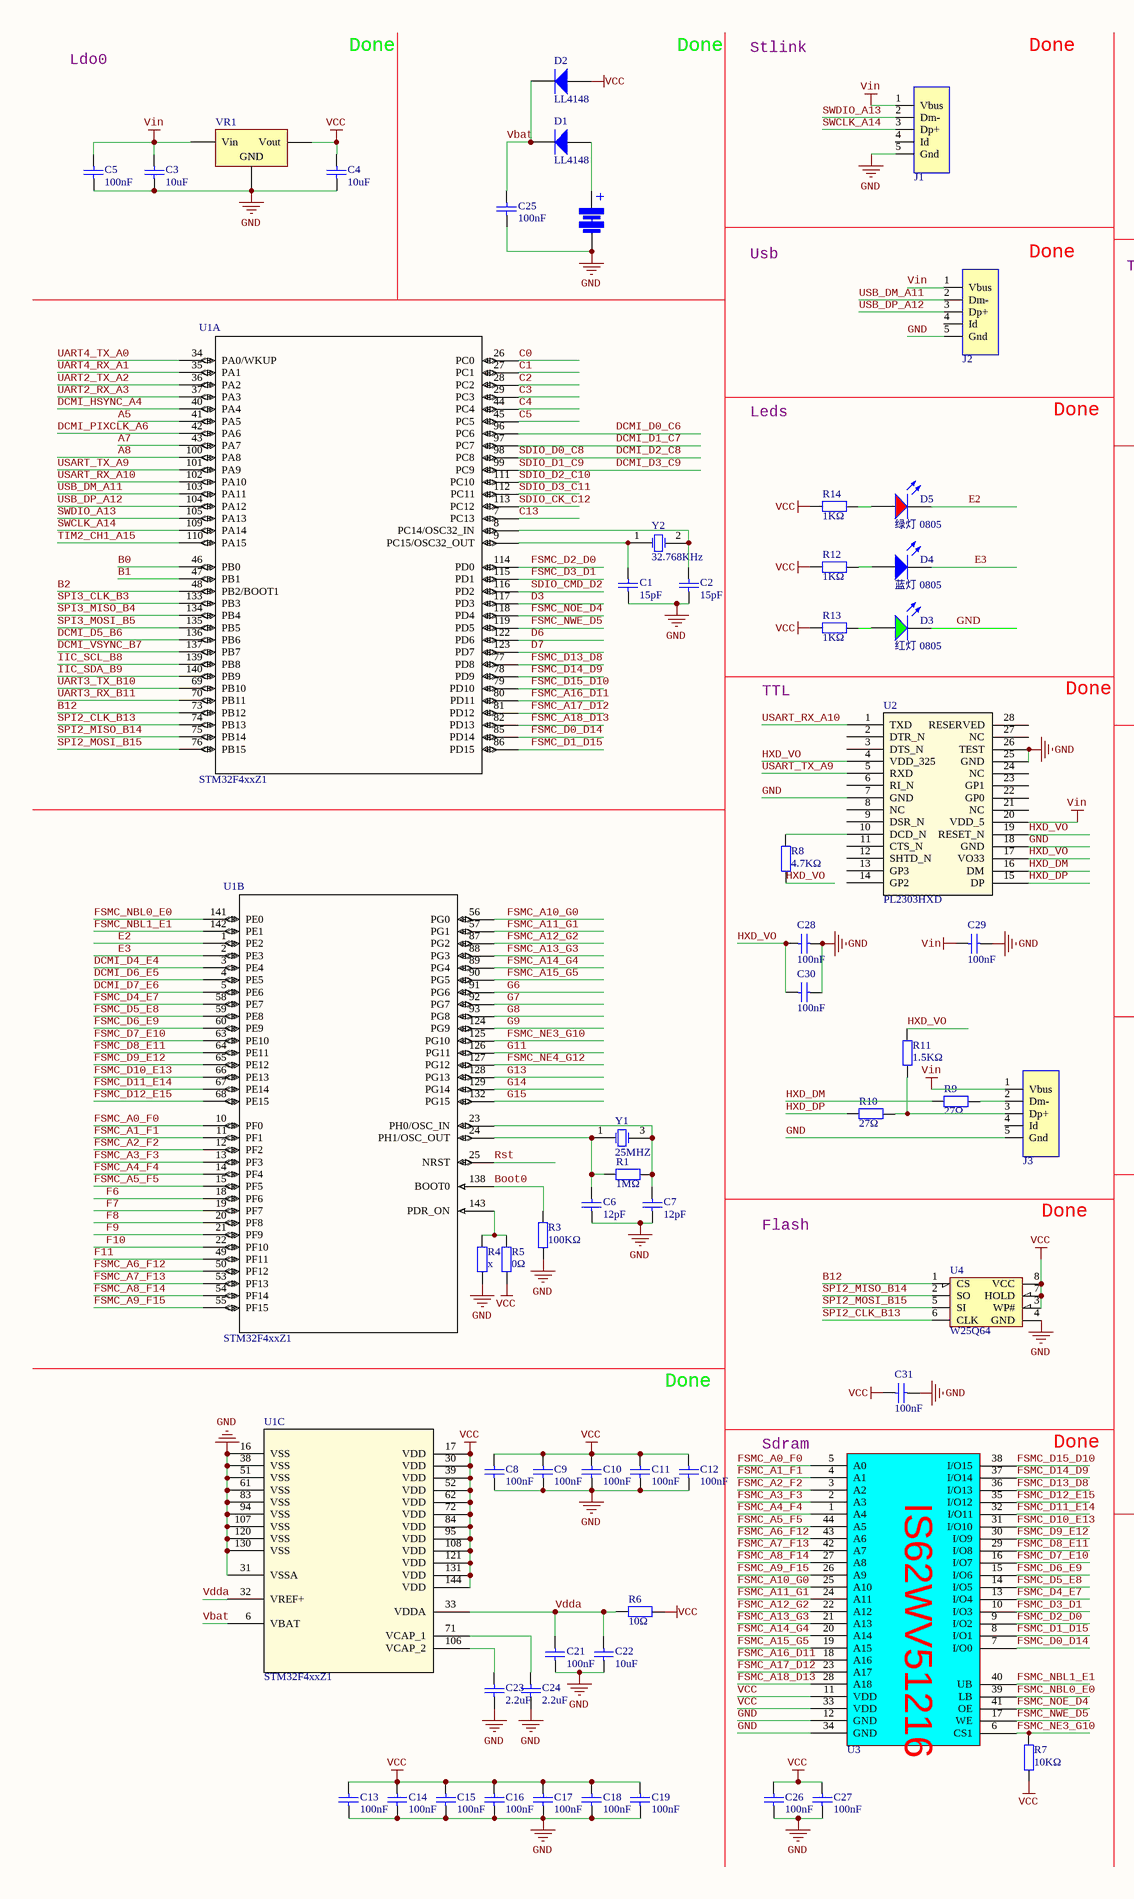
[diagram p5: ArmPcb.SchDoc, left]
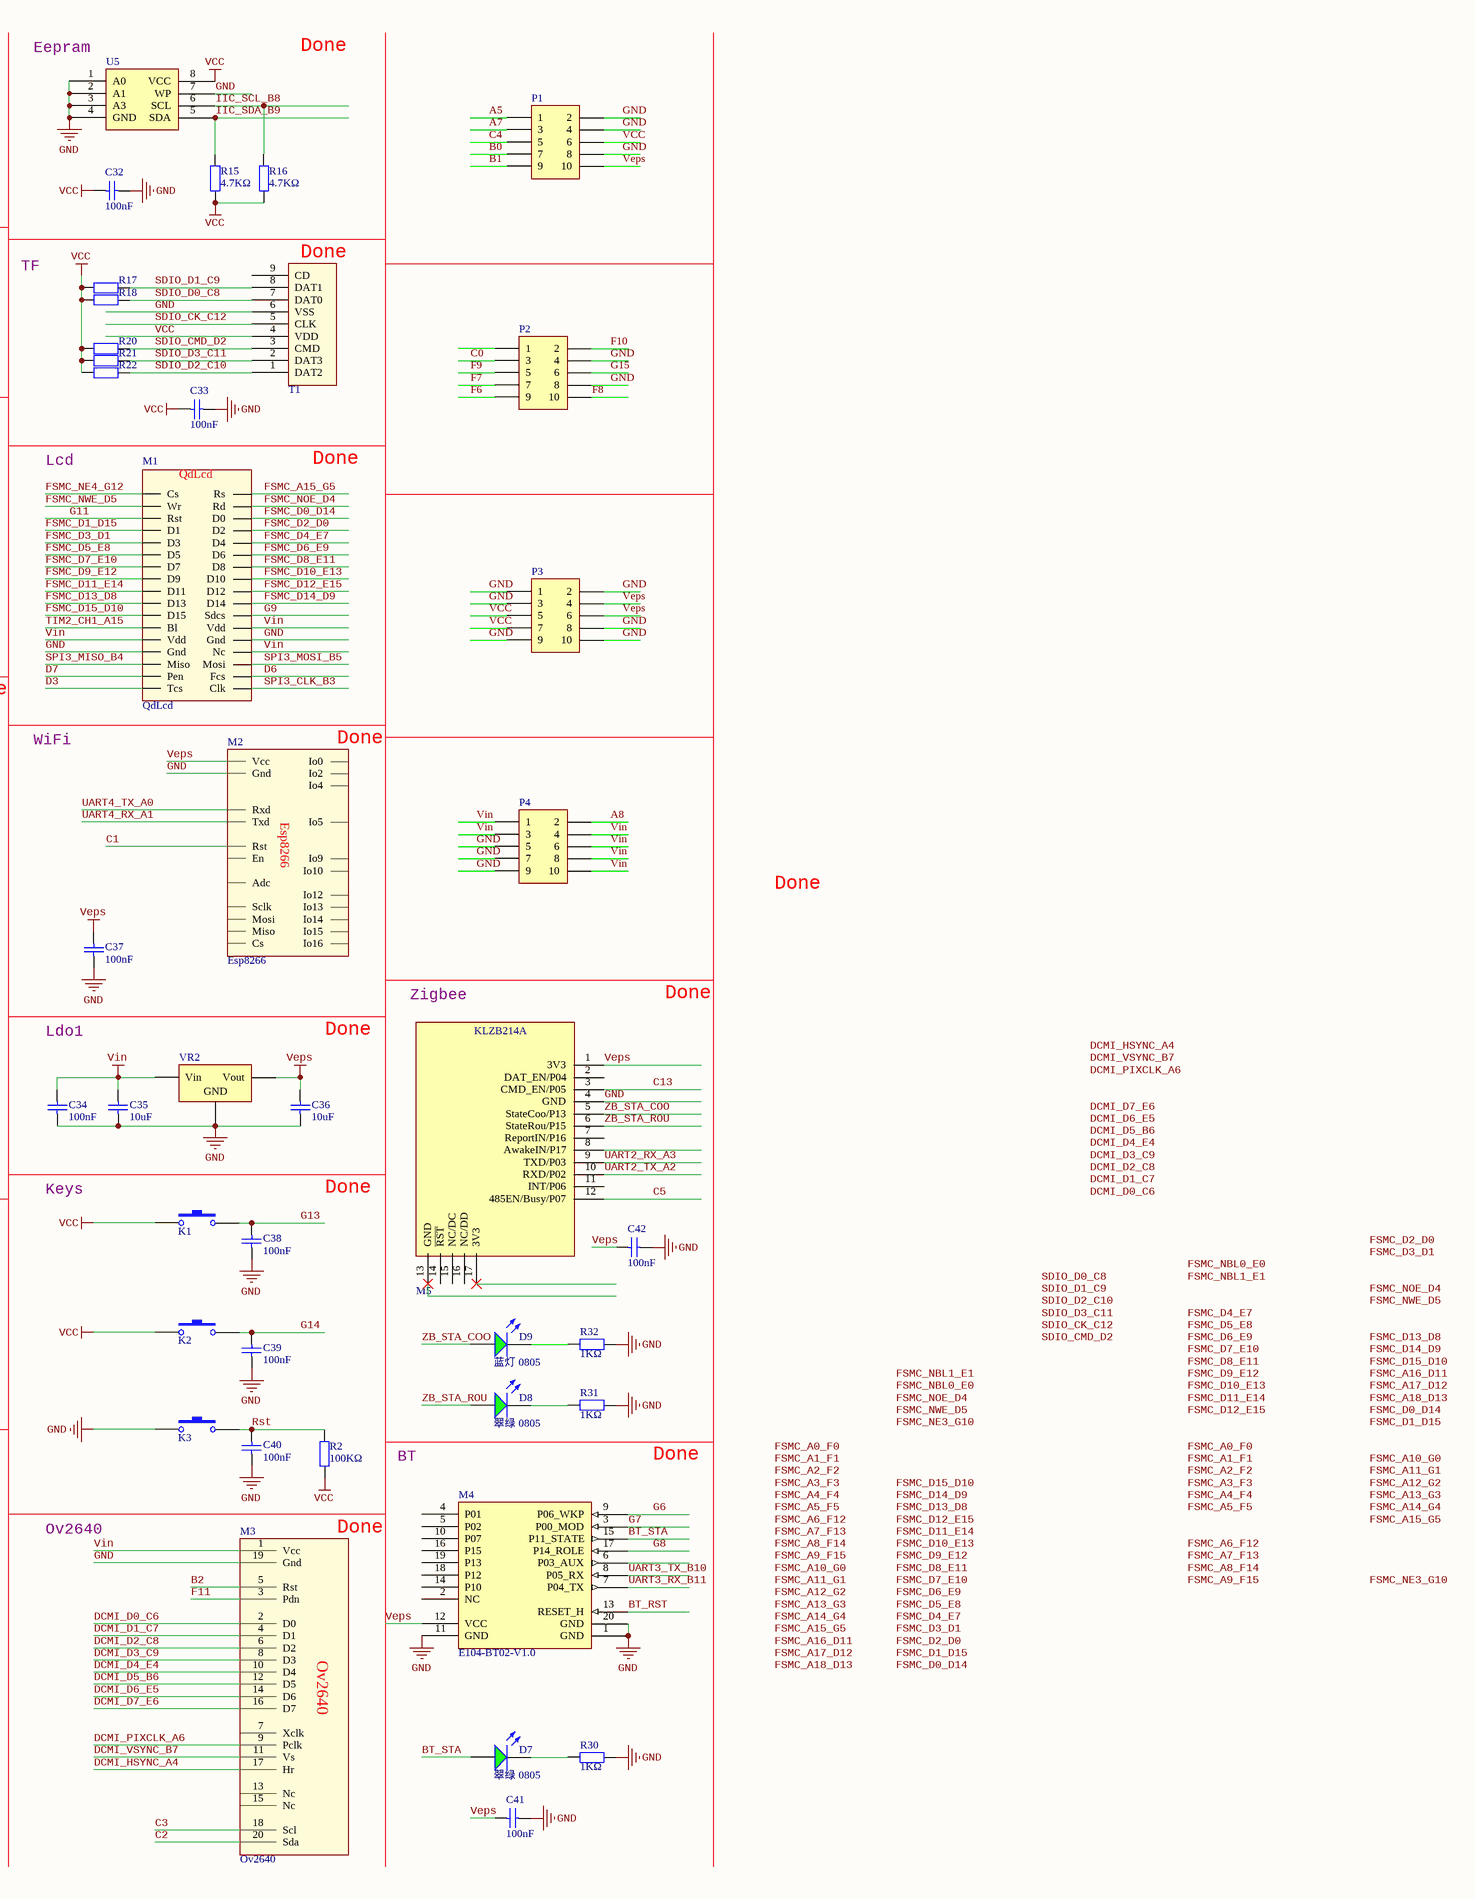
[diagram p6: ArmPcb.SchDoc, right]

### Parts
(Parts that share a designator on the sheet are numbered #1, #2 ... from top to bottom, then left to right.)
B1#1  BATTERY  [BATTERY]  (value not drawn)
C1#6  15pF  [0603_C]
C2#6  15pF  [0603_C]
C3#5  10uF  [0805_C]
C4#5  10uF  [0805_C]
C5#3  100nF  [0603_C]
C6#3  12pF  [0603_C]
C7#3  12pF  [0603_C]
C8#3  100nF  [0603_C]
C9#3  100nF  [0603_C]
C10#3  100nF  [0603_C]
C11#3  100nF  [0603_C]
C12#3  100nF  [0603_C]
C13#3  100nF  [0603_C]
C14#3  100nF  [0603_C]
C15#3  100nF  [0603_C]
C16#3  100nF  [0603_C]
C17#3  100nF  [0603_C]
C18#2  100nF  [0603_C]
C19#2  100nF  [0603_C]
C21#2  100nF  [0603_C]
C22#2  10uF  [0603_C]
C23#2  2.2uF  [0603_C]
C24#2  2.2uF  [0603_C]
C25#2  100nF  [0603_C]
C26#2  100nF  [0603_C]
C27#2  100nF  [0603_C]
C28  100nF  [0603_C]
C29  100nF  [0603_C]
C30  100nF  [0603_C]
C31  100nF  [0603_C]
C32  100nF  [0603_C]
C33  100nF  [0603_C]
C34  100nF  [0603_C]
C35  10uF  [0805_C]
C36  10uF  [0805_C]
C37  100nF  [0603_C]
C38  100nF  [0603_C]
C39  100nF  [0603_C]
C40  100nF  [0603_C]
C41  100nF  [0603_C]
C42  100nF  [0603_C]
D1#4  LL4148  [LL-34]
D2#2  LL4148  [LL-34]
D3#1  红灯 0805  [0805_LED_S1]
D4  蓝灯 0805  [0805_LED_S1]
D5  绿灯 0805  [0805_LED_S1]
D7  翠绿 0805  [0805_LED_S1]
D8  翠绿 0805  [0805_LED_S1]
D9  蓝灯 0805  [0805_LED_S1]
J1#3  UsbOtg  [USB-MINI-A]  (value not drawn)
J2#2  UsbOtg  [USB-MICRO_E]  (value not drawn)
J3#2  UsbOtg  [USB-MICRO_E]  (value not drawn)
K1#1  SW  [SWITCH]  (value not drawn)
K2#1  SW  [SWITCH]  (value not drawn)
K3#1  SW  [SWITCH]  (value not drawn)
M1#1  QdLcd  [TFTLCD]
M2#1  Esp8266  [ESP8266]
M3#1  Ov2640  [FPC0.5 OV2640]
M4#1  E104-BT02-V1.0  [PE104-BT02]
M5#1  KLZB214A  [KLZB214A_M]  (value not drawn)
P1#3  Header 5X2  [HDR2.54-M-LS-2x5P]  (value not drawn)
P2#3  Header 5X2  [HDR2.54-M-LS-2x5P]  (value not drawn)
P3#3  Header 5X2  [HDR2.54-M-LS-2x5P]  (value not drawn)
P4#3  Header 5X2  [HDR2.54-M-LS-2x5P]  (value not drawn)
R1#5  1MΩ  [0603_R]
R2#5  100KΩ  [0603_R]
R3#5  100KΩ  [0603_R]
R4#5  x  [0603_R]
R5#4  0Ω  [0603_R]
R6#3  10Ω  [0603_R]
R7#2  10KΩ  [0603_R]
R8#2  4.7KΩ  [0603_R]
R9#2  27Ω  [0603_R]
R10#2  27Ω  [0603_R]
R11#2  1.5KΩ  [0603_R]
R12#2  1KΩ  [0603_R]
R13  1KΩ  [0603_R]
R14  1KΩ  [0603_R]
R15#1  4.7KΩ  [0603_R]
R16  4.7KΩ  [0603_R]
R17  47KΩ  [0603_R]  (value not drawn)
R18#1  47KΩ  [0603_R]  (value not drawn)
R20#1  47KΩ  [0603_R]  (value not drawn)
R21#1  47KΩ  [0603_R]  (value not drawn)
R22  47KΩ  [0603_R]  (value not drawn)
R30  1KΩ  [0603_R]
R31  1KΩ  [0603_R]
R32  1KΩ  [0603_R]
T1  TFCard  [TF-CARD]  (value not drawn)
U1#5  STM32F4xxZ1  [LQFP144]  (parts A,B,C of 3)
U2#6  PL2303HXD  [SSOP28]
U3#2  IS62WV51216  [TSOP44]  (value not drawn)
U4#2  W25Q64  [SOP8_W]
U5  EAT24C256C  [SOP8_L]  (value not drawn)
VR1#1  AMS1117-3.3  [SOT-223]  (value not drawn)
VR2  AMS1117-3.3  [SOT-223]  (value not drawn)
Y1#4  25MHZ  [SMD-3225_4P]
Y2#3  32.768KHz  [SMD-3215_2P FC - 135]

### Nets
GND: B1#1.2(-) C1#6.1 C2#6.1 C3#5.1 C4#5.1 C5#3.1 C6#3.1 C7#3.1 C8#3.1 C9#3.1 C10#3.1 C11#3.1 C12#3.1 C13#3.1 C14#3.1 C15#3.1 C16#3.1 C17#3.1 C18#2.1 C19#2.1 C21#2.1 C22#2.1 C23#2.1 C24#2.1 C25#2.1 C26#2.1 C27#2.1 C28.1 C29.1 C30.1 C31.2 C32.2 C33.2 C34.1 C35.1 C36.1 C37.1 C38.1 C39.1 C40.1 C41.1 C42.1 D3#1.K J1#3.5(Gnd) J2#2.5(Gnd) J3#2.5(Gnd) K3#1.1 M1#1.26(Gnd) M1#1.27(Gnd) M2#1.15(Gnd) M3#1.19(Gnd) M4#1.1(GND) M4#1.11(GND) M4#1.20(GND) M5#1.4(GND) P1#3.2 P1#3.4 P1#3.8 P2#3.4 P2#3.8 P3#3.1 P3#3.2 P3#3.3 P3#3.8 P3#3.9 P3#3.10 P4#3.5 P4#3.7 P4#3.9 R3#5.1 R4#5.1 R30.1 R31.1 R32.1 T1.6(VSS) U1#5.16(VSS) U1#5.31(VSSA) U1#5.38(VSS) U1#5.51(VSS) U1#5.61(VSS) U1#5.83(VSS) U1#5.94(VSS) U1#5.107(VSS) U1#5.120(VSS) U1#5.130(VSS) U2#6.7(GND) U2#6.18(GND) U2#6.25(GND) U2#6.26(TEST) U3#2.12(GND) U3#2.34(GND) U4#2.4(GND) U5.1(A0) U5.2(A1) U5.3(A3) U5.4(GND) U5.7(WP) VR1#1.1(GND) VR2.1(GND)
VCC: C4#5.2 C8#3.2 C9#3.2 C10#3.2 C11#3.2 C12#3.2 C13#3.2 C14#3.2 C15#3.2 C16#3.2 C17#3.2 C18#2.2 C19#2.2 C26#2.2 C27#2.2 C31.1 C32.1 C33.1 D2#2.1(A) K1#1.1 K2#1.1 P1#3.6 P3#3.5 P3#3.7 R2#5.1 R5#4.1 R6#3.2 R7#2.1 R12#2.2 R13.2 R14.2 R15#1.2 R16.2 R17.1 R18#1.1 R20#1.1 R21#1.1 R22.1 T1.4(VDD) U1#5.17(VDD) U1#5.30(VDD) U1#5.39(VDD) U1#5.52(VDD) U1#5.62(VDD) U1#5.72(VDD) U1#5.84(VDD) U1#5.95(VDD) U1#5.108(VDD) U1#5.121(VDD) U1#5.131(VDD) U1#5.144(VDD) U3#2.11(VDD) U3#2.33(VDD) U4#2.3(WP#) U4#2.7(HOLD) U4#2.8(VCC) U5.8(VCC) VR1#1.2(Vout)
Veps: C36.2 C37.2 C41.2 C42.2 M2#1.8(Vcc) M4#1.12(VCC) M5#1.1(3V3) P1#3.10 P3#3.4 P3#3.6 VR2.2(Vout)
Vin: C3#5.2 C5#3.2 C29.2 C34.2 C35.2 J1#3.1(Vbus) J2#2.1(Vbus) J3#2.1(Vbus) M1#1.24(Vdd) M1#1.25(Vdd) M1#1.28(Nc) M3#1.1(Vcc) P4#3.1 P4#3.3 P4#3.4 P4#3.6 P4#3.8 P4#3.10 U2#6.20(VDD_5) VR1#1.3(Vin) VR2.3(Vin)
A5: P1#3.1 U1#5.41(PA5)
A7: P1#3.3 U1#5.43(PA7)
A8: P4#3.2 U1#5.100(PA8)
B0: P1#3.7 U1#5.46(PB0)
B1: P1#3.9 U1#5.47(PB1)
B2: M3#1.5(Rst) U1#5.48(PB2/BOOT1)
B12: U1#5.73(PB12) U4#2.1(CS)
Boot0: R3#5.2 U1#5.138(BOOT0)
BT_RST: M4#1.13(RESET_H)
BT_STA: D7.A M4#1.15(P11_STATE)
C0: P2#3.3 U1#5.26(PC0)
C1: M2#1.1(Rst) U1#5.27(PC1)
C2: M3#1.20(Sda) U1#5.28(PC2)
C3: M3#1.18(Scl) U1#5.29(PC3)
C4: P1#3.5 U1#5.44(PC4)
C5: M5#1.12(485EN/Busy/P07) U1#5.45(PC5)
C13: M5#1.3(CMD_EN/P05) U1#5.7(PC13)
D3: M1#1.33(Tcs) U1#5.117(PD3)
D6: M1#1.32(Fcs) U1#5.122(PD6)
D7: M1#1.31(Pen) U1#5.123(PD7)
DCMI_D0_C6: M3#1.2(D0) U1#5.96(PC6)
DCMI_D1_C7: M3#1.4(D1) U1#5.97(PC7)
DCMI_D2_C8: M3#1.6(D2) R18#1.2 T1.7(DAT0) U1#5.98(PC8)  [also labelled SDIO_D0_C8]
DCMI_D3_C9: M3#1.8(D3) R17.2 T1.8(DAT1) U1#5.99(PC9)  [also labelled SDIO_D1_C9]
DCMI_D4_E4: M3#1.10(D4) U1#5.3(PE4)
DCMI_D5_B6: M3#1.12(D5) U1#5.136(PB6)
DCMI_D6_E5: M3#1.14(D6) U1#5.4(PE5)
DCMI_D7_E6: M3#1.16(D7) U1#5.5(PE6)
DCMI_HSYNC_A4: M3#1.17(Hr) U1#5.40(PA4)
DCMI_PIXCLK_A6: M3#1.9(Pclk) U1#5.42(PA6)
DCMI_VSYNC_B7: M3#1.11(Vs) U1#5.137(PB7)
E2: D5.K U1#5.1(PE2)
E3: D4.K U1#5.2(PE3)
F6: P2#3.9 U1#5.18(PF6)
F7: P2#3.7 U1#5.19(PF7)
F8: P2#3.10 U1#5.20(PF8)
F9: P2#3.5 U1#5.21(PF9)
F10: P2#3.2 U1#5.22(PF10)
F11: M3#1.3(Pdn) U1#5.49(PF11)
FSMC_A0_F0: U1#5.10(PF0) U3#2.5(A0)
FSMC_A1_F1: U1#5.11(PF1) U3#2.4(A1)
FSMC_A2_F2: U1#5.12(PF2) U3#2.3(A2)
FSMC_A3_F3: U1#5.13(PF3) U3#2.2(A3)
FSMC_A4_F4: U1#5.14(PF4) U3#2.1(A4)
FSMC_A5_F5: U1#5.15(PF5) U3#2.44(A5)
FSMC_A6_F12: U1#5.50(PF12) U3#2.43(A6)
FSMC_A7_F13: U1#5.53(PF13) U3#2.42(A7)
FSMC_A8_F14: U1#5.54(PF14) U3#2.27(A8)
FSMC_A9_F15: U1#5.55(PF15) U3#2.26(A9)
FSMC_A10_G0: U1#5.56(PG0) U3#2.25(A10)
FSMC_A11_G1: U1#5.57(PG1) U3#2.24(A11)
FSMC_A12_G2: U1#5.87(PG2) U3#2.22(A12)
FSMC_A13_G3: U1#5.88(PG3) U3#2.21(A13)
FSMC_A14_G4: U1#5.89(PG4) U3#2.20(A14)
FSMC_A15_G5: M1#1.2(Rs) U1#5.90(PG5) U3#2.19(A15)
FSMC_A16_D11: U1#5.80(PD11) U3#2.18(A16)
FSMC_A17_D12: U1#5.81(PD12) U3#2.23(A17)
FSMC_A18_D13: U1#5.82(PD13) U3#2.28(A18)
FSMC_D0_D14: M1#1.6(D0) U1#5.85(PD14) U3#2.7(I/O0)
FSMC_D1_D15: M1#1.7(D1) U1#5.86(PD15) U3#2.8(I/O1)
FSMC_D2_D0: M1#1.8(D2) U1#5.114(PD0) U3#2.9(I/O2)
FSMC_D3_D1: M1#1.9(D3) U1#5.115(PD1) U3#2.10(I/O3)
FSMC_D4_E7: M1#1.10(D4) U1#5.58(PE7) U3#2.13(I/O4)
FSMC_D5_E8: M1#1.11(D5) U1#5.59(PE8) U3#2.14(I/O5)
FSMC_D6_E9: M1#1.12(D6) U1#5.60(PE9) U3#2.15(I/O6)
FSMC_D7_E10: M1#1.13(D7) U1#5.63(PE10) U3#2.16(I/O7)
FSMC_D8_E11: M1#1.14(D8) U1#5.64(PE11) U3#2.29(I/O8)
FSMC_D9_E12: M1#1.15(D9) U1#5.65(PE12) U3#2.30(I/O9)
FSMC_D10_E13: M1#1.16(D10) U1#5.66(PE13) U3#2.31(I/O10)
FSMC_D11_E14: M1#1.17(D11) U1#5.67(PE14) U3#2.32(I/O11)
FSMC_D12_E15: M1#1.18(D12) U1#5.68(PE15) U3#2.35(I/O12)
FSMC_D13_D8: M1#1.19(D13) U1#5.77(PD8) U3#2.36(I/O13)
FSMC_D14_D9: M1#1.20(D14) U1#5.78(PD9) U3#2.37(I/O14)
FSMC_D15_D10: M1#1.21(D15) U1#5.79(PD10) U3#2.38(I/O15)
FSMC_NBL0_E0: U1#5.141(PE0) U3#2.39(LB)
FSMC_NBL1_E1: U1#5.142(PE1) U3#2.40(UB)
FSMC_NE3_G10: R7#2.2 U1#5.125(PG10) U3#2.6(CS1)
FSMC_NE4_G12: M1#1.1(Cs) U1#5.127(PG12)
FSMC_NOE_D4: M1#1.4(Rd) U1#5.118(PD4) U3#2.41(OE)
FSMC_NWE_D5: M1#1.3(Wr) U1#5.119(PD5) U3#2.17(WE)
G6: M4#1.9(P06_WKP) U1#5.91(PG6)
G7: M4#1.3(P00_MOD) U1#5.92(PG7)
G8: M4#1.17(P14_ROLE) U1#5.93(PG8)
G9: M1#1.22(Sdcs) U1#5.124(PG9)
G11: M1#1.5(Rst) U1#5.126(PG11)
G13: C38.2 K1#1.2 U1#5.128(PG13)
G14: C39.2 K2#1.2 U1#5.129(PG14)
G15: P2#3.6 U1#5.132(PG15)
HXD_DM: R9#2.1 U2#6.16(DM)
HXD_DP: R10#2.1 U2#6.15(DP)
HXD_VO: C28.2 C30.2 R8#2.2 R11#2.2 U2#6.4(VDD_325) U2#6.17(VO33) U2#6.19(RESET_N)
IIC_SCL_B8: R16.1 U1#5.139(PB8) U5.6(SCL)
IIC_SDA_B9: R15#1.1 U1#5.140(PB9) U5.5(SDA)
Rst: C40.2 K3#1.2 R2#5.2 U1#5.25(NRST)
SDIO_CK_C12: T1.5(CLK) U1#5.113(PC12)
SDIO_CMD_D2: R20#1.2 T1.3(CMD) U1#5.116(PD2)
SDIO_D2_C10: R22.2 T1.1(DAT2) U1#5.111(PC10)
SDIO_D3_C11: R21#1.2 T1.2(DAT3) U1#5.112(PC11)
SPI2_CLK_B13: U1#5.74(PB13) U4#2.6(CLK)
SPI2_MISO_B14: U1#5.75(PB14) U4#2.2(SO)
SPI2_MOSI_B15: U1#5.76(PB15) U4#2.5(SI)
SPI3_CLK_B3: M1#1.34(Clk) U1#5.133(PB3)
SPI3_MISO_B4: M1#1.29(Miso) U1#5.134(PB4)
SPI3_MOSI_B5: M1#1.30(Mosi) U1#5.135(PB5)
SWCLK_A14: J1#3.3(Dp+) U1#5.109(PA14)
SWDIO_A13: J1#3.2(Dm-) U1#5.105(PA13)
TIM2_CH1_A15: M1#1.23(Bl) U1#5.110(PA15)
UART2_RX_A3: M5#1.9(TXD/P03) U1#5.37(PA3)
UART2_TX_A2: M5#1.10(RXD/P02) U1#5.36(PA2)
UART3_RX_B11: M4#1.7(P04_TX) U1#5.70(PB11)
UART3_TX_B10: M4#1.8(P05_RX) U1#5.69(PB10)
UART4_RX_A1: M2#1.22(Txd) U1#5.35(PA1)
UART4_TX_A0: M2#1.21(Rxd) U1#5.34(PA0/WKUP)
USART_RX_A10: U1#5.102(PA10) U2#6.1(TXD)
USART_TX_A9: U1#5.101(PA9) U2#6.5(RXD)
USB_DM_A11: J2#2.2(Dm-) U1#5.103(PA11)
USB_DP_A12: J2#2.3(Dp+) U1#5.104(PA12)
Vbat: C25#2.2 D1#4.2(K) D2#2.2(K) U1#5.6(VBAT)
Vdda: C21#2.2 C22#2.2 R6#3.1 U1#5.32(VREF+) U1#5.33(VDDA)
ZB_STA_COO: D9.A M5#1.5(StateCoo/P13)
ZB_STA_ROU: D8.A M5#1.6(StateRou/P15)
NetB1#1_1: B1#1.1(+) D1#4.1(A)
NetC1#6_2: C1#6.2 U1#5.9(PC15/OSC32_OUT) Y2#3.1(OSC1)
NetC2#6_2: C2#6.2 U1#5.8(PC14/OSC32_IN) Y2#3.2(OSC2)
NetC6#3_2: C6#3.2 R1#5.1 U1#5.24(PH1/OSC_OUT) Y1#4.1(OSC1)
NetC7#3_2: C7#3.2 R1#5.2 U1#5.23(PH0/OSC_IN) Y1#4.3(OSC2)
NetC23#2_2: C23#2.2 U1#5.106(VCAP_2)
NetC24#2_2: C24#2.2 U1#5.71(VCAP_1)
NetD3#1_A: D3#1.A R13.1
NetD4_A: D4.A R12#2.1
NetD5_A: D5.A R14.1
NetD7_K: D7.K R30.2
NetD8_K: D8.K R31.2
NetD9_K: D9.K R32.2
NetJ3#2_2: J3#2.2(Dm-) R9#2.2
NetJ3#2_3: J3#2.3(Dp+) R10#2.2 R11#2.1
NetR4#5_2: R4#5.2 R5#4.2 U1#5.143(PDR_ON)
NetR8#2_1: R8#2.1 U2#6.10(DCD_N)

Not connected (* = marked no-connect by the designer): J1#3 4(Id); J2#2 4(Id); J3#2 4(Id); M2#1 2(Adc) 3(En) 4(Io16) 5(Io14) 6(Io12) 7(Io13) 9(Sclk) 10(Mosi) 11(Io10) 12(Io9) 13(Miso) 14(Cs) 16(Io15) 17(Io2) 18(Io0) 19(Io4) 20(Io5); M3#1 7(Xclk) 13(Nc) 15(Nc); M4#1 2(NC) 4(P01) 5(P02) 6(P03_AUX) 10(P07) 14(P10) 16(P15) 18(P12) 19(P13); M5#1 2(DAT_EN/P04) 7(ReportIN/P16) 8(AwakeIN/P17) 11(INT/P06) 13(GND)* 14(~{RST}) 15(NC/DC) 16(NC/DD) 17(3V3)*; P2#3 1; T1 9(CD); U2#6 2(DTR_N) 3(DTS_N) 6(RI_N) 8(NC) 9(DSR_N) 11(CTS_N) 12(SHTD_N) 13(GP3) 14(GP2) 21(NC) 22(GP0) 23(GP1) 24(NC) 27(NC) 28(RESERVED)

### Notes on the sheet
- Ldo0
- Done
- Stlink
- (near U5) Eepram
- Usb
- TF
- (near T1) Done
- Leds
- Lcd
- TTL
- WiFi
- (near M2#1) Done
- Zigbee
- Ldo1
- Keys
- Flash
- Sdram
- BT
- Ov2640
- Labels drawn without touching a wire or pin: DCMI_D0_C6, DCMI_D1_C7, DCMI_D2_C8, DCMI_D3_C9, DCMI_D4_E4, DCMI_D5_B6, DCMI_D6_E5, DCMI_D7_E6, DCMI_HSYNC_A4, DCMI_PIXCLK_A6, DCMI_VSYNC_B7, FSMC_A0_F0, FSMC_A1_F1, FSMC_A2_F2, FSMC_A3_F3, FSMC_A4_F4, FSMC_A5_F5, FSMC_A6_F12, FSMC_A7_F13, FSMC_A8_F14, FSMC_A9_F15, FSMC_A10_G0, FSMC_A11_G1, FSMC_A12_G2, FSMC_A13_G3, FSMC_A14_G4, FSMC_A15_G5, FSMC_A16_D11, FSMC_A17_D12, FSMC_A18_D13, FSMC_D0_D14, FSMC_D1_D15, FSMC_D2_D0, FSMC_D3_D1, FSMC_D4_E7, FSMC_D5_E8, FSMC_D6_E9, FSMC_D7_E10, FSMC_D8_E11, FSMC_D9_E12, FSMC_D10_E13, FSMC_D11_E14, FSMC_D12_E15, FSMC_D13_D8, FSMC_D14_D9, FSMC_D15_D10, FSMC_NBL0_E0, FSMC_NBL1_E1, FSMC_NE3_G10, FSMC_NOE_D4, FSMC_NWE_D5, SDIO_CK_C12, SDIO_CMD_D2, SDIO_D0_C8, SDIO_D1_C9, SDIO_D2_C10, SDIO_D3_C11
- Title
- Size:
- Date:
- File:
- A2
- Number:
- Time:
- Revision:
- Sheet
- of

### Library data of the parts
B1#1 = BATTERY: 纽扣电池
C1#6 C2#6 = 0603 15pF (150) 5% 50V: 贴片电容; ComponentLink1Description: 供应商链接; ComponentLink1URL: http://www.szlcsc.com/product/details_1996.html; Package: 0603; Supplier: LC; SuppliersPartNumber: C1644
C3#5 C4#5 C35 C36 = 0805 10uF (106) 10% 25V: 贴片电容; ComponentLink1Description: 供应商链接; ComponentLink1URL: http://www.szlcsc.com/product/details_16532.html; Package: 0805; Supplier: LC; SuppliersPartNumber: C15850
C5#3 C8#3 C9#3 C10#3 C11#3 C12#3 C13#3 C14#3 C15#3 C16#3 C17#3 C18#2 C19#2 C21#2 C25#2 C26#2 C27#2 C28-C34 C37-C42 = 0603 100nF (104) 10% 50V: 贴片电容; ComponentLink1Description: 供应商链接; ComponentLink1URL: http://www.szlcsc.com/product/details_15331.html; Package: 0603; Supplier: LC; SuppliersPartNumber: C14663
C6#3 C7#3 = 0603 12pF (120) 5% 50V: 贴片电容; ComponentLink1Description: 供应商链接; ComponentLink1URL: http://www.szlcsc.com/product/details_39506.html; Package: 0603; Supplier: LC; SuppliersPartNumber: C38523
C22#2 = 0603 10uF (106) 10% 10V: 贴片电容; ComponentLink1Description: 供应商链接; ComponentLink1URL: http://www.szlcsc.com/product/details_20411.html; Package: 0603; Supplier: LC; SuppliersPartNumber: C19702
C23#2 C24#2 = 0603 2.2uF (225) 10% 16V: 贴片电容; ComponentLink1Description: 供应商链接; ComponentLink1URL: http://www.szlcsc.com/product/details_24366.html; Package: 0603; Supplier: LC; SuppliersPartNumber: C23630
D1#4 D2#2 = LL-34 LL4148 LL-34 1206: 开关二极管; ComponentLink1Description: 供应商链接; ComponentLink1URL: http://www.szlcsc.com/product/details_10338.html; Package: LL-34; Supplier: LC; SuppliersPartNumber: C9808
D3#1 D7-D9 = 0805 翠绿: 发光二极管; ComponentLink1Description: 供应商链接; ComponentLink1URL: http://www.szlcsc.com/product/details_2670.html; Package: 0805; Supplier: LC; SuppliersPartNumber: C2297
D4 = 0805 蓝灯: 发光二极管; ComponentLink1Description: 供应商链接; ComponentLink1URL: http://www.szlcsc.com/product/details_2666.html; Package: 0805; Supplier: LC; SuppliersPartNumber: C2293
D5 = 0805 红灯: 发光二极管; ComponentLink1Description: 供应商链接; ComponentLink1URL: http://www.szlcsc.com/product/details_2668.html; Package: 0805; Supplier: LC; SuppliersPartNumber: C2295
K1#1 K2#1 K3#1 = SW: Switch
M5#1 = KLZB214A: zigbee to uart
P1#3 P2#3 P3#3 P4#3 = Header 5X2: Header, 5-Pin, Dual row; LatestRevisionDate: 17-Jul-2002; LatestRevisionNote: Re-released for DXP Platform.; Publisher: Altium Limited
R1#5 = 0603 1MΩ (1004) 1%: 贴片电阻; ComponentLink1Description: 供应商链接; ComponentLink1URL: http://www.szlcsc.com/product/details_23662.html; Package: 0603; Supplier: LC; SuppliersPartNumber: C22935
R2#5 R3#5 = 0603 100KΩ (1003) 1%: 贴片电阻; ComponentLink1Description: 供应商链接; ComponentLink1URL: http://www.szlcsc.com/product/details_26546.html; Package: 0603; Supplier: LC; SuppliersPartNumber: C25803
R4#5 R5#4 = 0603 0Ω (0R0) 1%: 贴片电阻; ComponentLink1Description: 供应商链接; ComponentLink1URL: http://www.szlcsc.com/product/details_21903.html; Package: 0603; Supplier: LC; SuppliersPartNumber: C21189
R6#3 = 0603 10Ω (10R0) 1%: 贴片电阻; ComponentLink1Description: 供应商链接; ComponentLink1URL: http://www.szlcsc.com/product/details_23586.html; Package: 0603; Supplier: LC; SuppliersPartNumber: C22859
R7#2 R8#2 R9#2 R10#2 R11#2 R12#2 R13 R14 R15#1 R16 R30-R32 = 0603 10KΩ (1002) 1%: 贴片电阻; ComponentLink1Description: 供应商链接; ComponentLink1URL: http://www.szlcsc.com/product/details_26547.html; Package: 0603; Supplier: LC; SuppliersPartNumber: C25804
R17 R18#1 R20#1 R21#1 R22 = 0603 47KΩ (4702) 1%: 贴片电阻; ComponentLink1Description: 供应商链接; ComponentLink1URL: http://www.szlcsc.com/product/details_26562.html; Package: 0603; Supplier: LC; SuppliersPartNumber: C25819
U1#5 = STM32F4xxZ1: as U1#4 on sheet FxxZx; Manufacturer_Part_Number: stm32f4xxz1; Copyright: Copyright (C) 2016 Accelerated Designs. All rights reserved; RefDes: RefDes; Type: Type; Value: Value
U2#6 = PL2303HXD: as U1#1 on sheet PL2303EVM; Manufacturer: Texas Instruments; Datasheet_URL: http://www.ti.com/lit/gpn/TLC5916-Q1; Value: Value; Type: Type; RefDes: RefDes
U3#2 = IS62WV51216: 外部SRAM
U4#2 = W25X16: W25X16;SST25VF016;MX25L1605
U5 = AT24C256C: EEPROM; ComponentLink1Description: 供应商链接; ComponentLink1URL: http://www.szlcsc.com/product/details_6947.html; Package: SOIC-8_150mil; Supplier: LC; SuppliersPartNumber: C6482
VR1#1 VR2 = SOT-223 AMS1117-3.3: 低压差线性稳压(LDO); ComponentLink1Description: 供应商链接; ComponentLink1URL: http://www.szlcsc.com/product/details_6652.html; Package: SOT-223; Supplier: LC; SuppliersPartNumber: C6186
Y1#4 = SMD-3225_4P  25MHZ 12PF 10PPM: 贴片晶振; ComponentLink1Description: 供应商链接; ComponentLink1URL: http://www.szlcsc.com/product/details_9526.html; Package: SMD-3225_4P; Supplier: LC; SuppliersPartNumber: C9006
Y2#3 = SMD-3215_2P 32.768KHz 20ppm 12.5pF: 贴片晶振; ComponentLink1Description: 供应商链接; ComponentLink1URL: http://www.szlcsc.com/product/details_33310.html; Package: SMD-3215_2P; Supplier: LC; SuppliersPartNumber: C32346

## Sheet ST_All.SchDoc
size A4
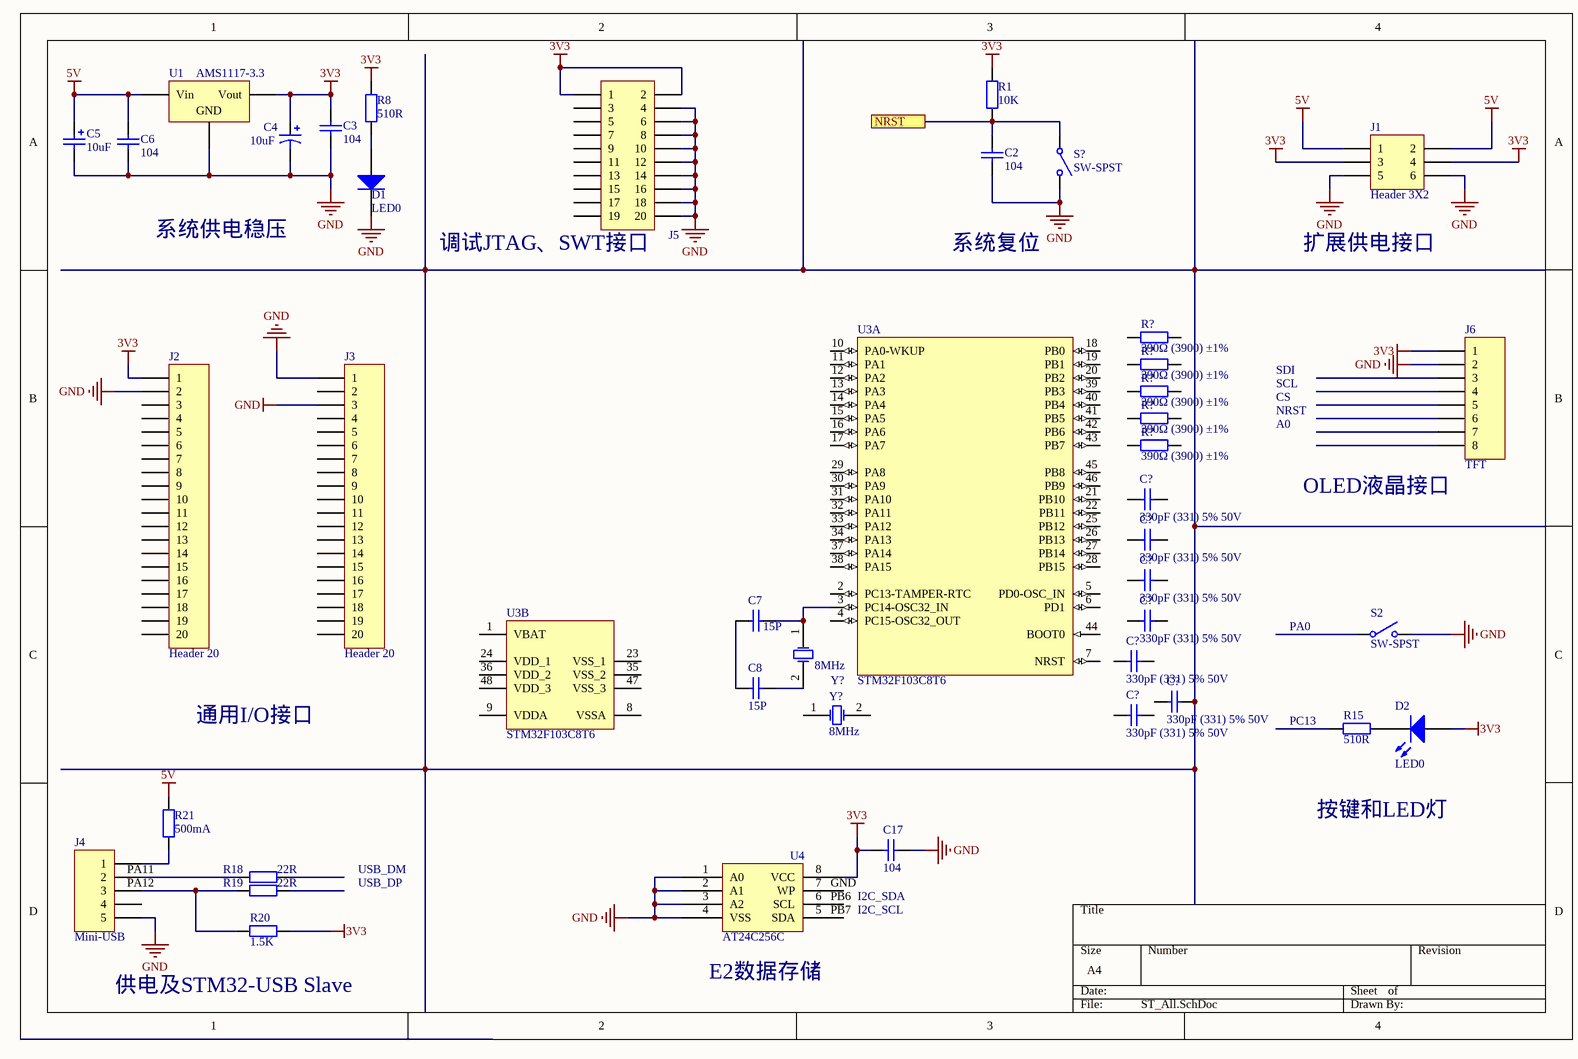
[diagram p7: ST_All.SchDoc]

### Parts
(Parts that share a designator on the sheet are numbered #1, #2 ... from top to bottom, then left to right.)
C2#7  104  [0603_C]
C3#6  104  [0402_C]
C4#6  10uF  [CC6.56.5]
C5#4  10uF  [CASE-B_3528]
C6#4  104  [0402_C]
C7#4  15P  [0603_C]
C8#4  15P  [0603_C]
C17#4  104  [0402_C]
C?#1  330pF (331) 5% 50V  [0603_C]
C?#2  330pF (331) 5% 50V  [0603_C]
C?#3  330pF (331) 5% 50V  [0603_C]
C?#4  330pF (331) 5% 50V  [0603_C]
C?#5  330pF (331) 5% 50V  [0603_C]
C?#6  330pF (331) 5% 50V  [0603_C]
C?#7  330pF (331) 5% 50V  [0603_C]
D1#5  LED0  [SMC(DO-214AB)_S1]
D2#3  LED0  [0603_LED_S1]
J1#4  Header 3X2  [MHDR2X3]
J2#3  Header 20  [HDR1X20]
J3#3  Header 20  [HDR1X20]
J4#1  Mini-USB  [HDR1X5]
J5  (no value)  [MHDR2X10]
J6  TFT  [MHDR1X8]
R1#6  10K  [0603_R]
R8#3  510R  [0402_R]
R15#2  510R  [0805_R]
R18#2  22R  [0402_R]
R19#1  22R  [0402_R]
R20#2  1.5K  [0402_R]
R21#2  500mA  [0402_R]
R?#1  390Ω (3900) ±1%  [0603_R]
R?#2  390Ω (3900) ±1%  [0603_R]
R?#3  390Ω (3900) ±1%  [0603_R]
R?#4  390Ω (3900) ±1%  [0603_R]
R?#5  390Ω (3900) ±1%  [0603_R]
S2  SW-SPST  [SPST-2]
S?  SW-SPST  [SPST-2]
U1#6  AMS1117-3.3  [SOT-223]
U3#3  STM32F103C8T6  [LQFP-48_7x7x05P]  (parts A,B of 2)
U4#3  AT24C256C  [SOP8_L]
Y?#1  8MHz  [XTAL_US]
Y?#2  8MHz  [XTAL_US]

### Ports
NRST

### Nets
3V3: C3#6.1 C4#6.2 C17#4.1 D2#3.A J1#4.3 J1#4.4 J2#3.1 J5.1 J5.2 J6.1 R1#6.2 R8#3.2 R20#2.2 U1#6.2(Vout) U4#3.8(VCC)
5V: C5#4.1 C6#4.2 J1#4.1 J1#4.2 R21#2.2 U1#6.3(Vin)
GND: C2#7.1 C3#6.2 C4#6.1 C5#4.2 C6#4.1 C17#4.2 D1#5.2(K) J1#4.5 J1#4.6 J2#3.2 J3#3.1 J3#3.3 J4#1.1(5) J5.4 J5.6 J5.8 J5.10 J5.12 J5.14 J5.16 J5.18 J5.20 J6.2 S2.2(NO) S?.2(NO) U1#6.1(GND) U4#3.1(A0) U4#3.2(A1) U4#3.3(A2) U4#3.4(VSS)
NetC2#7_2: C2#7.2 R1#6.1 S?.1(COMMON) ; port NRST
NetC7#4_1: C7#4.1 C8#4.1
NetC7#4_2: C7#4.2 U3#3.3(PC14-OSC32_IN) Y?#1.1(OSC1)
NetC8#4_2: C8#4.2 Y?#1.2(OSC2)
NetD1#5_1: D1#5.1(A) R8#3.1
NetD2#3_K: D2#3.K R15#2.2
NetJ4#1_5: J4#1.5(1) R21#2.1
NetJ4#1_PA11: J4#1.PA11(2) R18#2.1
NetJ4#1_PA12: J4#1.PA12(3) R19#1.1 R20#2.1

Not connected (* = marked no-connect by the designer): C?#1 1 2; C?#2 1 2; C?#3 1 2; C?#4 1 2; C?#5 1 2; C?#6 1 2; C?#7 1 2; J2#3 PA0(8) PA1(9) PA2(10) PA3(11) PA4(12) PA5(13) PA6(14) PA7(15) PB0(16) PB1(17) PB2(18) PB10(19) PB11(20) PC13(4) PC14(5) PC15(6) VBAT(3) VDDA(7); J3#3 BOOT0(2) PA8(16) PA9(15) PA10(14) PA11(13) PA12(12) PB5(8) PB6(7) PB7(6) PB8(5) PB9(4) PB12(20) PB13(19) PB14(18) PB15(17) TD0/PB3(10) TD1/PA15(11) TRST/PB4(9); J4#1 2(4); J5 11 17 19 NRST(15) TCLK(9) TDI/PA15(5) TDO/PB3(13) TMS(7) TRST/PB4(3); J6 8 NRST(6) PB1(7) PB12(5) PB13(4) PB15(3); R15#2 1; R18#2 2; R19#1 2; R?#1 1 2; R?#2 1 2; R?#3 1 2; R?#4 1 2; R?#5 1 2; S2 1(COMMON); U3#3 1(VBAT) 2(PC13-TAMPER-RTC) 4(PC15-OSC32_OUT) 5(PD0-OSC_IN) 6(PD1) 7(NRST) 8(VSSA) 9(VDDA) 10(PA0-WKUP) 11(PA1) 12(PA2) 13(PA3) 14(PA4) 15(PA5) 16(PA6) 17(PA7) 18(PB0) 19(PB1) 20(PB2) 21(PB10) 22(PB11) 23(VSS_1) 24(VDD_1) 25(PB12) 26(PB13) 27(PB14) 28(PB15) 29(PA8) 30(PA9) 31(PA10) 32(PA11) 33(PA12) 34(PA13) 35(VSS_2) 36(VDD_2) 37(PA14) 38(PA15) 39(PB3) 40(PB4) 41(PB5) 42(PB6) 43(PB7) 44(BOOT0) 45(PB8) 46(PB9) 47(VSS_3) 48(VDD_3); U4#3 5   PB7(SDA) 6   PB6(SCL) 7   GND(WP); Y?#2 1(OSC1) 2(OSC2)

### Notes on the sheet
- 系统供电稳压
- (near J5) 调试JTAG、SWT接口
- 系统复位
- 扩展供电接口
- SDI
- SCL
- CS
- NRST
- A0
- OLED液晶接口
- PA0
- 通用I/O接口
- (near R15#2) PC13
- 按键和LED灯
- USB_DM
- USB_DP
- I2C_SDA
- I2C_SCL
- 供电及STM32-USB Slave
- (near U4#3) E2数据存储

### Library data of the parts
C2#7 = 0603 2.2nF (222) 10% 50V: 贴片电容; ComponentLink1Description: 供应商链接; ComponentLink1URL: http://www.szlcsc.com/product/details_1956.html; Package: 0603; Supplier: LC; SuppliersPartNumber: C1604
C3#6 C6#4 = 0402 1.0uF (105) 10% 25V: 贴片电容; ComponentLink1Description: 供应商链接; ComponentLink1URL: http://www.szlcsc.com/product/details_53938.html; Package: 0402; Supplier: LC; SuppliersPartNumber: C52923
C4#6 = Cp: Polarized Capacitor (Axial); Published: 8-Jun-2000; LatestRevisionDate: 17-Jul-2002; LatestRevisionNote: Re-released for DXP Platform.; PackageReference: POLAR0.8; Publisher: Altium Limited; PackageDescription: Polarized Capacitor; 2 Leads
C5#4 = 3528 100uF (107) 10% 6.3V: 钽电容; ComponentLink1Description: 供应商链接; ComponentLink1URL: http://www.szlcsc.com/product/details_16815.html; Package: 3528; Supplier: LC; SuppliersPartNumber: C16133
C7#4 C8#4 C?#1-C?#7 = 0603 330pF (331) 5% 50V: 贴片电容; ComponentLink1Description: 供应商链接; ComponentLink1URL: http://www.szlcsc.com/product/details_2016.html; Package: 0603; Supplier: LC; SuppliersPartNumber: C1664
C17#4 = 0402 470pF (471) 10% 50V: 贴片电容; ComponentLink1Description: 供应商链接; ComponentLink1URL: http://www.szlcsc.com/product/details_1889.html; Package: 0402; Supplier: LC; SuppliersPartNumber: C1537
D1#5 = SMC(DO-214AB) SS36-E3/57T: 二极管; ComponentLink1Description: 供应商链接; ComponentLink1URL: http://www.szlcsc.com/product/details_36698.html; Package: SMC(DO-214AB); Supplier: LC; SuppliersPartNumber: C35722
D2#3 = 0603 蓝灯: 发光二极管; ComponentLink1Description: 供应商链接; ComponentLink1URL: http://www.szlcsc.com/product/details_73150.html; Package: 0603; Supplier: LC; SuppliersPartNumber: C72041
J1#4 = MHDR2X3: Header, 3-Pin, Dual row; LatestRevisionDate: 17-Jul-2002; LatestRevisionNote: Re-released for DXP Platform.; Publisher: Altium Limited
J2#3 J3#3 = Header 20: Header, 20-Pin; LatestRevisionDate: 17-Jul-2002; LatestRevisionNote: Re-released for DXP Platform.; Publisher: Altium Limited
J4#1 = Header 5: Header, 5-Pin; LatestRevisionDate: 17-Jul-2002; LatestRevisionNote: Re-released for DXP Platform.; Publisher: Altium Limited
J5 = MHDR2X10: Header, 10-Pin, Dual row; LatestRevisionDate: 17-Jul-2002; LatestRevisionNote: Re-released for DXP Platform.; Publisher: Altium Limited
J6 = MHDR1X8: Header, 8-Pin; LatestRevisionDate: 17-Jul-2002; LatestRevisionNote: Re-released for DXP Platform.; Publisher: Altium Limited
R1#6 = 0603 2.2MΩ (2204) 1%: 贴片电阻; ComponentLink1Description: 供应商链接; ComponentLink1URL: http://www.szlcsc.com/product/details_23665.html; Package: 0603; Supplier: LC; SuppliersPartNumber: C22938
R8#3 = 0402 1KΩ (1001) 1%: 贴片电阻; ComponentLink1Description: 供应商链接; ComponentLink1URL: http://www.szlcsc.com/product/details_12256.html; Package: 0402; Supplier: LC; SuppliersPartNumber: C11702
R15#2 = 0805 200Ω (2000) 1%: 贴片电阻; ComponentLink1Description: 供应商链接; ComponentLink1URL: http://www.szlcsc.com/product/details_18228.html; Package: 0805; Supplier: LC; SuppliersPartNumber: C17540
R18#2 R19#1 R20#2 R21#2 = 0402 470KΩ (4703) 1%: 贴片电阻; ComponentLink1Description: 供应商链接; ComponentLink1URL: http://www.szlcsc.com/product/details_26533.html; Package: 0402; Supplier: LC; SuppliersPartNumber: C25790
R?#1-R?#5 = 0603 390Ω (3900) 1%: 贴片电阻; ComponentLink1Description: 供应商链接; ComponentLink1URL: http://www.szlcsc.com/product/details_23878.html; Package: 0603; Supplier: LC; SuppliersPartNumber: C23151
S2 S? = SW-SPST: Single-Pole, Single-Throw Switch; Published: 24-Mar-1999; LatestRevisionDate: 17-Jul-2002; LatestRevisionNote: Re-released for DXP Platform.; PackageReference: SPST-2; Publisher: Altium Limited
U1#6 = SOT-223 AMS1117-3.3: 低压差线性稳压(LDO); ComponentLink1Description: 供应商链接; ComponentLink1URL: http://www.szlcsc.com/product/details_6652.html; Package: SOT-223; Supplier: LC; SuppliersPartNumber: C6186
U3#3 = STM32F103C8T6: ARM; ComponentLink1Description: 供应商链接; ComponentLink1URL: http://www.szlcsc.com/product/details_9243.html; Package: LQFP-48_7x7x05P; Supplier: LC; SuppliersPartNumber: C8734
U4#3 = AT24C256C: EEPROM; ComponentLink1Description: 供应商链接; ComponentLink1URL: http://www.szlcsc.com/product/details_6947.html; Package: SOIC-8_150mil; Supplier: LC; SuppliersPartNumber: C6482
Y?#1 Y?#2 = XTAL: Crystal Oscillator; Published: 8-Jun-2000; LatestRevisionDate: 17-Jul-2002; LatestRevisionNote: Re-released for DXP Platform.; Publisher: Altium Limited